# Altium project Controller-RK3562.PrjPcb (part 2 of 8)

## Sheet RK3562-POWER-GND.SchDoc
size 299 x 209 mm; SheetNumber: 4; SheetTotal: 32
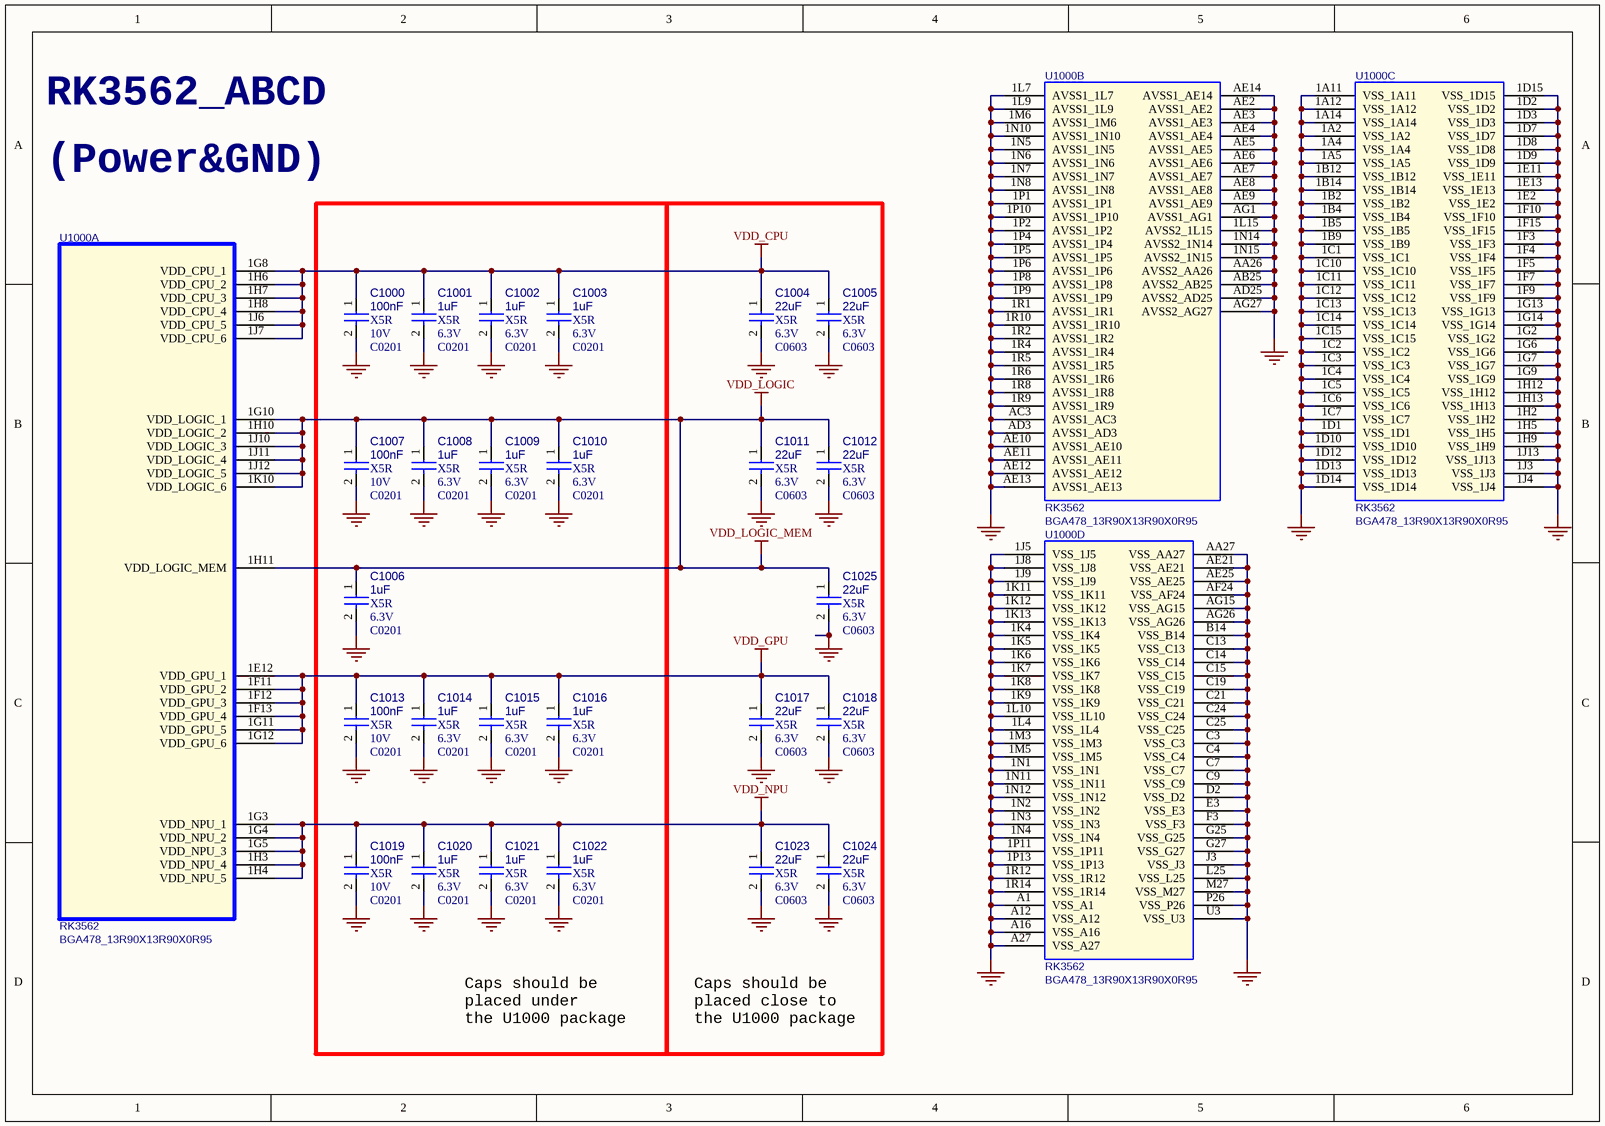
[diagram p5: RK3562-POWER-GND.SchDoc]

### Parts
C1000  100nF  Dielectric: X5R  Voltage: 10V  [C0201]
C1001  1uF  Dielectric: X5R  Voltage: 6.3V  [C0201]
C1002  1uF  Dielectric: X5R  Voltage: 6.3V  [C0201]
C1003  1uF  Dielectric: X5R  Voltage: 6.3V  [C0201]
C1004  22uF  Dielectric: X5R  Voltage: 6.3V  [C0603]
C1005  22uF  Dielectric: X5R  Voltage: 6.3V  [C0603]
C1006  1uF  Dielectric: X5R  Voltage: 6.3V  [C0201]
C1007  100nF  Dielectric: X5R  Voltage: 10V  [C0201]
C1008  1uF  Dielectric: X5R  Voltage: 6.3V  [C0201]
C1009  1uF  Dielectric: X5R  Voltage: 6.3V  [C0201]
C1010  1uF  Dielectric: X5R  Voltage: 6.3V  [C0201]
C1011  22uF  Dielectric: X5R  Voltage: 6.3V  [C0603]
C1012  22uF  Dielectric: X5R  Voltage: 6.3V  [C0603]
C1013  100nF  Dielectric: X5R  Voltage: 10V  [C0201]
C1014  1uF  Dielectric: X5R  Voltage: 6.3V  [C0201]
C1015  1uF  Dielectric: X5R  Voltage: 6.3V  [C0201]
C1016  1uF  Dielectric: X5R  Voltage: 6.3V  [C0201]
C1017  22uF  Dielectric: X5R  Voltage: 6.3V  [C0603]
C1018  22uF  Dielectric: X5R  Voltage: 6.3V  [C0603]
C1019  100nF  Dielectric: X5R  Voltage: 10V  [C0201]
C1020  1uF  Dielectric: X5R  Voltage: 6.3V  [C0201]
C1021  1uF  Dielectric: X5R  Voltage: 6.3V  [C0201]
C1022  1uF  Dielectric: X5R  Voltage: 6.3V  [C0201]
C1023  22uF  Dielectric: X5R  Voltage: 6.3V  [C0603]
C1024  22uF  Dielectric: X5R  Voltage: 6.3V  [C0603]
C1025  22uF  Dielectric: X5R  Voltage: 6.3V  [C0603]
U1000  RK3562  [BGA478_13R90X13R90X0R95]  (parts A,B,C,D of 16)

### Nets
GND: C1000.2 C1001.2 C1002.2 C1003.2 C1004.2 C1005.2 C1006.2 C1007.2 C1008.2 C1009.2 C1010.2 C1011.2 C1012.2 C1013.2 C1014.2 C1015.2 C1016.2 C1017.2 C1018.2 C1019.2 C1020.2 C1021.2 C1022.2 C1023.2 C1024.2 C1025.2 U1000.1A2(VSS_1A2) U1000.1A4(VSS_1A4) U1000.1A5(VSS_1A5) U1000.1A11(VSS_1A11) U1000.1A12(VSS_1A12) U1000.1A14(VSS_1A14) U1000.1B2(VSS_1B2) U1000.1B4(VSS_1B4) U1000.1B5(VSS_1B5) U1000.1B9(VSS_1B9) U1000.1B12(VSS_1B12) U1000.1B14(VSS_1B14) U1000.1C1(VSS_1C1) U1000.1C2(VSS_1C2) U1000.1C3(VSS_1C3) U1000.1C4(VSS_1C4) U1000.1C5(VSS_1C5) U1000.1C6(VSS_1C6) U1000.1C7(VSS_1C7) U1000.1C10(VSS_1C10) U1000.1C11(VSS_1C11) U1000.1C12(VSS_1C12) U1000.1C13(VSS_1C13) U1000.1C14(VSS_1C14) U1000.1C15(VSS_1C15) U1000.1D1(VSS_1D1) U1000.1D2(VSS_1D2) U1000.1D3(VSS_1D3) U1000.1D7(VSS_1D7) U1000.1D8(VSS_1D8) U1000.1D9(VSS_1D9) U1000.1D10(VSS_1D10) U1000.1D12(VSS_1D12) U1000.1D13(VSS_1D13) U1000.1D14(VSS_1D14) U1000.1D15(VSS_1D15) U1000.1E2(VSS_1E2) U1000.1E11(VSS_1E11) U1000.1E13(VSS_1E13) U1000.1F3(VSS_1F3) U1000.1F4(VSS_1F4) U1000.1F5(VSS_1F5) U1000.1F7(VSS_1F7) U1000.1F9(VSS_1F9) U1000.1F10(VSS_1F10) U1000.1F15(VSS_1F15) U1000.1G2(VSS_1G2) U1000.1G6(VSS_1G6) U1000.1G7(VSS_1G7) U1000.1G9(VSS_1G9) U1000.1G13(VSS_1G13) U1000.1G14(VSS_1G14) U1000.1H2(VSS_1H2) U1000.1H5(VSS_1H5) U1000.1H9(VSS_1H9) U1000.1H12(VSS_1H12) U1000.1H13(VSS_1H13) U1000.1J3(VSS_1J3) U1000.1J4(VSS_1J4) U1000.1J5(VSS_1J5) U1000.1J8(VSS_1J8) U1000.1J9(VSS_1J9) U1000.1J13(VSS_1J13) U1000.1K4(VSS_1K4) U1000.1K5(VSS_1K5) U1000.1K6(VSS_1K6) U1000.1K7(VSS_1K7) U1000.1K8(VSS_1K8) U1000.1K9(VSS_1K9) U1000.1K11(VSS_1K11) U1000.1K12(VSS_1K12) U1000.1K13(VSS_1K13) U1000.1L4(VSS_1L4) U1000.1L7(AVSS1_1L7) U1000.1L9(AVSS1_1L9) U1000.1L10(VSS_1L10) U1000.1L15(AVSS2_1L15) U1000.1M3(VSS_1M3) U1000.1M5(VSS_1M5) U1000.1M6(AVSS1_1M6) U1000.1N1(VSS_1N1) U1000.1N2(VSS_1N2) U1000.1N3(VSS_1N3) U1000.1N4(VSS_1N4) U1000.1N5(AVSS1_1N5) U1000.1N6(AVSS1_1N6) U1000.1N7(AVSS1_1N7) U1000.1N8(AVSS1_1N8) U1000.1N10(AVSS1_1N10) U1000.1N11(VSS_1N11) U1000.1N12(VSS_1N12) U1000.1N14(AVSS2_1N14) U1000.1N15(AVSS2_1N15) U1000.1P1(AVSS1_1P1) U1000.1P2(AVSS1_1P2) U1000.1P4(AVSS1_1P4) U1000.1P5(AVSS1_1P5) U1000.1P6(AVSS1_1P6) U1000.1P8(AVSS1_1P8) U1000.1P9(AVSS1_1P9) U1000.1P10(AVSS1_1P10) U1000.1P11(VSS_1P11) U1000.1P13(VSS_1P13) U1000.1R1(AVSS1_1R1) U1000.1R2(AVSS1_1R2) U1000.1R4(AVSS1_1R4) U1000.1R5(AVSS1_1R5) U1000.1R6(AVSS1_1R6) U1000.1R8(AVSS1_1R8) U1000.1R9(AVSS1_1R9) U1000.1R10(AVSS1_1R10) U1000.1R12(VSS_1R12) U1000.1R14(VSS_1R14) U1000.A1(VSS_A1) U1000.A12(VSS_A12) U1000.A16(VSS_A16) U1000.A27(VSS_A27) U1000.AA26(AVSS2_AA26) U1000.AA27(VSS_AA27) U1000.AB25(AVSS2_AB25) U1000.AC3(AVSS1_AC3) U1000.AD3(AVSS1_AD3) U1000.AD25(AVSS2_AD25) U1000.AE2(AVSS1_AE2) U1000.AE3(AVSS1_AE3) U1000.AE4(AVSS1_AE4) U1000.AE5(AVSS1_AE5) U1000.AE6(AVSS1_AE6) U1000.AE7(AVSS1_AE7) U1000.AE8(AVSS1_AE8) U1000.AE9(AVSS1_AE9) U1000.AE10(AVSS1_AE10) U1000.AE11(AVSS1_AE11) U1000.AE12(AVSS1_AE12) U1000.AE13(AVSS1_AE13) U1000.AE14(AVSS1_AE14) U1000.AE21(VSS_AE21) U1000.AE25(VSS_AE25) U1000.AF24(VSS_AF24) U1000.AG1(AVSS1_AG1) U1000.AG15(VSS_AG15) U1000.AG26(VSS_AG26) U1000.AG27(AVSS2_AG27) U1000.B14(VSS_B14) U1000.C3(VSS_C3) U1000.C4(VSS_C4) U1000.C7(VSS_C7) U1000.C9(VSS_C9) U1000.C13(VSS_C13) U1000.C14(VSS_C14) U1000.C15(VSS_C15) U1000.C19(VSS_C19) U1000.C21(VSS_C21) U1000.C24(VSS_C24) U1000.C25(VSS_C25) U1000.D2(VSS_D2) U1000.E3(VSS_E3) U1000.F3(VSS_F3) U1000.G25(VSS_G25) U1000.G27(VSS_G27) U1000.J3(VSS_J3) U1000.L25(VSS_L25) U1000.M27(VSS_M27) U1000.P26(VSS_P26) U1000.U3(VSS_U3)
VDD_CPU: C1000.1 C1001.1 C1002.1 C1003.1 C1004.1 C1005.1 U1000.1G8(VDD_CPU_1) U1000.1H6(VDD_CPU_2) U1000.1H7(VDD_CPU_3) U1000.1H8(VDD_CPU_4) U1000.1J6(VDD_CPU_5) U1000.1J7(VDD_CPU_6)
VDD_GPU: C1013.1 C1014.1 C1015.1 C1016.1 C1017.1 C1018.1 U1000.1E12(VDD_GPU_1) U1000.1F11(VDD_GPU_2) U1000.1F12(VDD_GPU_3) U1000.1F13(VDD_GPU_4) U1000.1G11(VDD_GPU_5) U1000.1G12(VDD_GPU_6)
VDD_LOGIC: C1006.1 C1007.1 C1008.1 C1009.1 C1010.1 C1011.1 C1012.1 C1025.1 U1000.1G10(VDD_LOGIC_1) U1000.1H10(VDD_LOGIC_2) U1000.1H11(VDD_LOGIC_MEM) U1000.1J10(VDD_LOGIC_3) U1000.1J11(VDD_LOGIC_4) U1000.1J12(VDD_LOGIC_5) U1000.1K10(VDD_LOGIC_6)  [also labelled VDD_LOGIC_MEM]
VDD_NPU: C1019.1 C1020.1 C1021.1 C1022.1 C1023.1 C1024.1 U1000.1G3(VDD_NPU_1) U1000.1G4(VDD_NPU_2) U1000.1G5(VDD_NPU_3) U1000.1H3(VDD_NPU_4) U1000.1H4(VDD_NPU_5)

### Notes on the sheet
- RK3562_ABCD
- (Power&GND)
- Caps should be
  placed under
  the U1000 package
- Caps should be
  placed close to
  the U1000 package

### Library data of the parts
C1000 = CAP NP: cap,100.00nF,+/-10%,10V,X5R,C0201; Part Reference: C1000; Manufacturer PN: C0603X5R1A104K030BC; Manufacturer: TDK; Tolerance: 10%; Priority: A; PCB Footprint: C0201; Value: 100nF; Created by: JJJ; Part Type: C0201; RK PN: C0603X5R1A104K030BC; ClassName: RK
C1001 = CAP NP: cap,1.00uF,+/-20%,6.3V,X5R,C0201; Part Reference: C1001; Manufacturer: TDK; RK PN: C0603X5R0J105M030BC; Priority: A; Tolerance: 20%; PCB Footprint: C0201; Value: 1uF; Part Type: C0201; Manufacturer PN: C0603X5R0J105M030BC; Created by: JJJ; ClassName: RK
C1002 = CAP NP: cap,1.00uF,+/-20%,6.3V,X5R,C0201; Part Reference: C1002; Manufacturer PN: C0603X5R0J105M030BC; Manufacturer: TDK; Tolerance: 20%; Priority: A; PCB Footprint: C0201; Value: 1uF; Created by: JJJ; Part Type: C0201; RK PN: C0603X5R0J105M030BC; ClassName: RK
C1003 = CAP NP: cap,1.00uF,+/-20%,6.3V,X5R,C0201; Part Reference: C1003; Manufacturer PN: C0603X5R0J105M030BC; Manufacturer: TDK; Tolerance: 20%; Priority: A; PCB Footprint: C0201; Value: 1uF; Created by: JJJ; Part Type: C0201; RK PN: C0603X5R0J105M030BC; ClassName: RK
C1004 = CAP NP: cap,22.00uF,+/-20%,6.3V,X5R,C0603; Part Reference: C1004; Manufacturer PN: C1608X5R0J226M080AC; Manufacturer: TDK; Tolerance: 20%; Priority: A; PCB Footprint: C0603; Value: 22uF; Created by: JJJ; C_Voltage: 6.3V; Part Type: C0603; RK PN: C1608X5R0J226M080AC; ClassName: RK
C1005 = CAP NP: cap,22.00uF,+/-20%,6.3V,X5R,C0603; Part Reference: C1005; Manufacturer PN: C1608X5R0J226M080AC; Manufacturer: TDK; Tolerance: 20%; Priority: A; PCB Footprint: C0603; Value: 22uF; Created by: JJJ; C_Voltage: 6.3V; Part Type: C0603; RK PN: C1608X5R0J226M080AC; ClassName: RK
C1006 = CAP NP: cap,1.00uF,+/-20%,6.3V,X5R,C0201; Part Reference: C1006; Manufacturer PN: C0603X5R0J105M030BC; Manufacturer: TDK; Tolerance: 20%; Priority: A; PCB Footprint: C0201; Value: 1uF; Created by: JJJ; Part Type: C0201; RK PN: C0603X5R0J105M030BC; ClassName: RK
C1007 = CAP NP: cap,100.00nF,+/-10%,10V,X5R,C0201; Part Reference: C1007; Manufacturer PN: C0603X5R1A104K030BC; Manufacturer: TDK; Tolerance: 10%; Priority: A; PCB Footprint: C0201; Value: 100nF; Created by: JJJ; Part Type: C0201; RK PN: C0603X5R1A104K030BC; ClassName: RK
C1008 = CAP NP: cap,1.00uF,+/-20%,6.3V,X5R,C0201; Part Reference: C1008; Manufacturer: TDK; RK PN: C0603X5R0J105M030BC; Priority: A; Tolerance: 20%; PCB Footprint: C0201; Value: 1uF; Part Type: C0201; Manufacturer PN: C0603X5R0J105M030BC; Created by: JJJ; ClassName: RK
C1009 = CAP NP: cap,1.00uF,+/-20%,6.3V,X5R,C0201; Part Reference: C1009; Manufacturer PN: C0603X5R0J105M030BC; Manufacturer: TDK; Tolerance: 20%; Priority: A; PCB Footprint: C0201; Value: 1uF; Created by: JJJ; Part Type: C0201; RK PN: C0603X5R0J105M030BC; ClassName: RK
C1010 = CAP NP: cap,1.00uF,+/-20%,6.3V,X5R,C0201; Part Reference: C1010; Manufacturer PN: C0603X5R0J105M030BC; Manufacturer: TDK; Tolerance: 20%; Priority: A; PCB Footprint: C0201; Value: 1uF; Created by: JJJ; Part Type: C0201; RK PN: C0603X5R0J105M030BC; ClassName: RK
C1011 = CAP NP: cap,22.00uF,+/-20%,6.3V,X5R,C0603; Part Reference: C1011; Manufacturer PN: C1608X5R0J226M080AC; Manufacturer: TDK; Tolerance: 20%; Priority: A; PCB Footprint: C0603; Value: 22uF; Created by: JJJ; C_Voltage: 6.3V; Part Type: C0603; RK PN: C1608X5R0J226M080AC; ClassName: RK
C1012 = CAP NP: cap,22.00uF,+/-20%,6.3V,X5R,C0603; Part Reference: C1012; Manufacturer PN: C1608X5R0J226M080AC; Manufacturer: TDK; Tolerance: 20%; Priority: A; PCB Footprint: C0603; Value: 22uF; Created by: JJJ; C_Voltage: 6.3V; Part Type: C0603; RK PN: C1608X5R0J226M080AC; ClassName: RK
C1013 = CAP NP: cap,100.00nF,+/-10%,10V,X5R,C0201; Part Reference: C1013; Manufacturer PN: C0603X5R1A104K030BC; Manufacturer: TDK; Tolerance: 10%; Priority: A; PCB Footprint: C0201; Value: 100nF; Created by: JJJ; Part Type: C0201; RK PN: C0603X5R1A104K030BC; ClassName: RK
C1014 = CAP NP: cap,1.00uF,+/-20%,6.3V,X5R,C0201; Part Reference: C1014; Manufacturer: TDK; RK PN: C0603X5R0J105M030BC; Priority: A; Tolerance: 20%; PCB Footprint: C0201; Value: 1uF; Part Type: C0201; Manufacturer PN: C0603X5R0J105M030BC; Created by: JJJ; ClassName: RK
C1015 = CAP NP: cap,1.00uF,+/-20%,6.3V,X5R,C0201; Part Reference: C1015; Manufacturer PN: C0603X5R0J105M030BC; Manufacturer: TDK; Tolerance: 20%; Priority: A; PCB Footprint: C0201; Value: 1uF; Created by: JJJ; Part Type: C0201; RK PN: C0603X5R0J105M030BC; ClassName: RK
C1016 = CAP NP: cap,1.00uF,+/-20%,6.3V,X5R,C0201; Part Reference: C1016; Manufacturer PN: C0603X5R0J105M030BC; Manufacturer: TDK; Tolerance: 20%; Priority: A; PCB Footprint: C0201; Value: 1uF; Created by: JJJ; Part Type: C0201; RK PN: C0603X5R0J105M030BC; ClassName: RK
C1017 = CAP NP: cap,22.00uF,+/-20%,6.3V,X5R,C0603; Part Reference: C1017; Manufacturer PN: C1608X5R0J226M080AC; Manufacturer: TDK; Tolerance: 20%; Priority: A; PCB Footprint: C0603; Value: 22uF; Created by: JJJ; C_Voltage: 6.3V; Part Type: C0603; RK PN: C1608X5R0J226M080AC; ClassName: RK
C1018 = CAP NP: cap,22.00uF,+/-20%,6.3V,X5R,C0603; Part Reference: C1018; Manufacturer PN: C1608X5R0J226M080AC; Manufacturer: TDK; Tolerance: 20%; Priority: A; PCB Footprint: C0603; Value: 22uF; Created by: JJJ; C_Voltage: 6.3V; Part Type: C0603; RK PN: C1608X5R0J226M080AC; ClassName: RK
C1019 = CAP NP: cap,100.00nF,+/-10%,10V,X5R,C0201; Part Reference: C1019; Manufacturer PN: C0603X5R1A104K030BC; Manufacturer: TDK; Tolerance: 10%; Priority: A; PCB Footprint: C0201; Value: 100nF; Created by: JJJ; Part Type: C0201; RK PN: C0603X5R1A104K030BC; ClassName: RK
C1020 = CAP NP: cap,1.00uF,+/-20%,6.3V,X5R,C0201; Part Reference: C1020; Manufacturer: TDK; RK PN: C0603X5R0J105M030BC; Priority: A; Tolerance: 20%; PCB Footprint: C0201; Value: 1uF; Part Type: C0201; Manufacturer PN: C0603X5R0J105M030BC; Created by: JJJ; ClassName: RK
C1021 = CAP NP: cap,1.00uF,+/-20%,6.3V,X5R,C0201; Part Reference: C1021; Manufacturer PN: C0603X5R0J105M030BC; Manufacturer: TDK; Tolerance: 20%; Priority: A; PCB Footprint: C0201; Value: 1uF; Created by: JJJ; Part Type: C0201; RK PN: C0603X5R0J105M030BC; ClassName: RK
C1022 = CAP NP: cap,1.00uF,+/-20%,6.3V,X5R,C0201; Part Reference: C1022; Manufacturer: TDK; RK PN: C0603X5R0J105M030BC; Priority: A; Tolerance: 20%; PCB Footprint: C0201; Value: 1uF; Part Type: C0201; Manufacturer PN: C0603X5R0J105M030BC; Created by: JJJ; ClassName: RK
C1023 = CAP NP: cap,22.00uF,+/-20%,6.3V,X5R,C0603; Part Reference: C1023; Manufacturer PN: C1608X5R0J226M080AC; Manufacturer: TDK; Tolerance: 20%; Priority: A; PCB Footprint: C0603; Value: 22uF; Created by: JJJ; C_Voltage: 6.3V; Part Type: C0603; RK PN: C1608X5R0J226M080AC; ClassName: RK
C1024 = CAP NP: cap,22.00uF,+/-20%,6.3V,X5R,C0603; Part Reference: C1024; Manufacturer PN: C1608X5R0J226M080AC; Manufacturer: TDK; Tolerance: 20%; Priority: A; PCB Footprint: C0603; Value: 22uF; Created by: JJJ; C_Voltage: 6.3V; Part Type: C0603; RK PN: C1608X5R0J226M080AC; ClassName: RK
C1025 = CAP NP: cap,22.00uF,+/-20%,6.3V,X5R,C0603; Part Reference: C1025; Manufacturer: TDK; RK PN: C1608X5R0J226M080AC; Priority: A; Tolerance: 20%; PCB Footprint: C0603; Value: 22uF; Part Type: C0603; C_Voltage: 6.3V; Manufacturer PN: C1608X5R0J226M080AC; Created by: JJJ; ClassName: RK
U1000 = SOC_RK3562: ROCKCHIP SOC; Part Reference: U1000; Manufacturer: Rockchip (瑞芯微); SPLIT_INST: TRUE; SWAP_INFO: (S1+S2+S3+S4+S5+S6+S7+S8+S9+S10+S11+S12+S13+S14+S15+S16); Priority: A; RK PN: 906000425; PCB Footprint: BGA478_13R90X13R90X0R95; Value: RK3562; Created by: JJJ; Manufacturer PN: RK3562; Part Type: SOC; ClassName: RK

## Sheet RK3562-DDR-PHY.SchDoc
size 420 x 297 mm; SheetNumber: 5; SheetTotal: 32
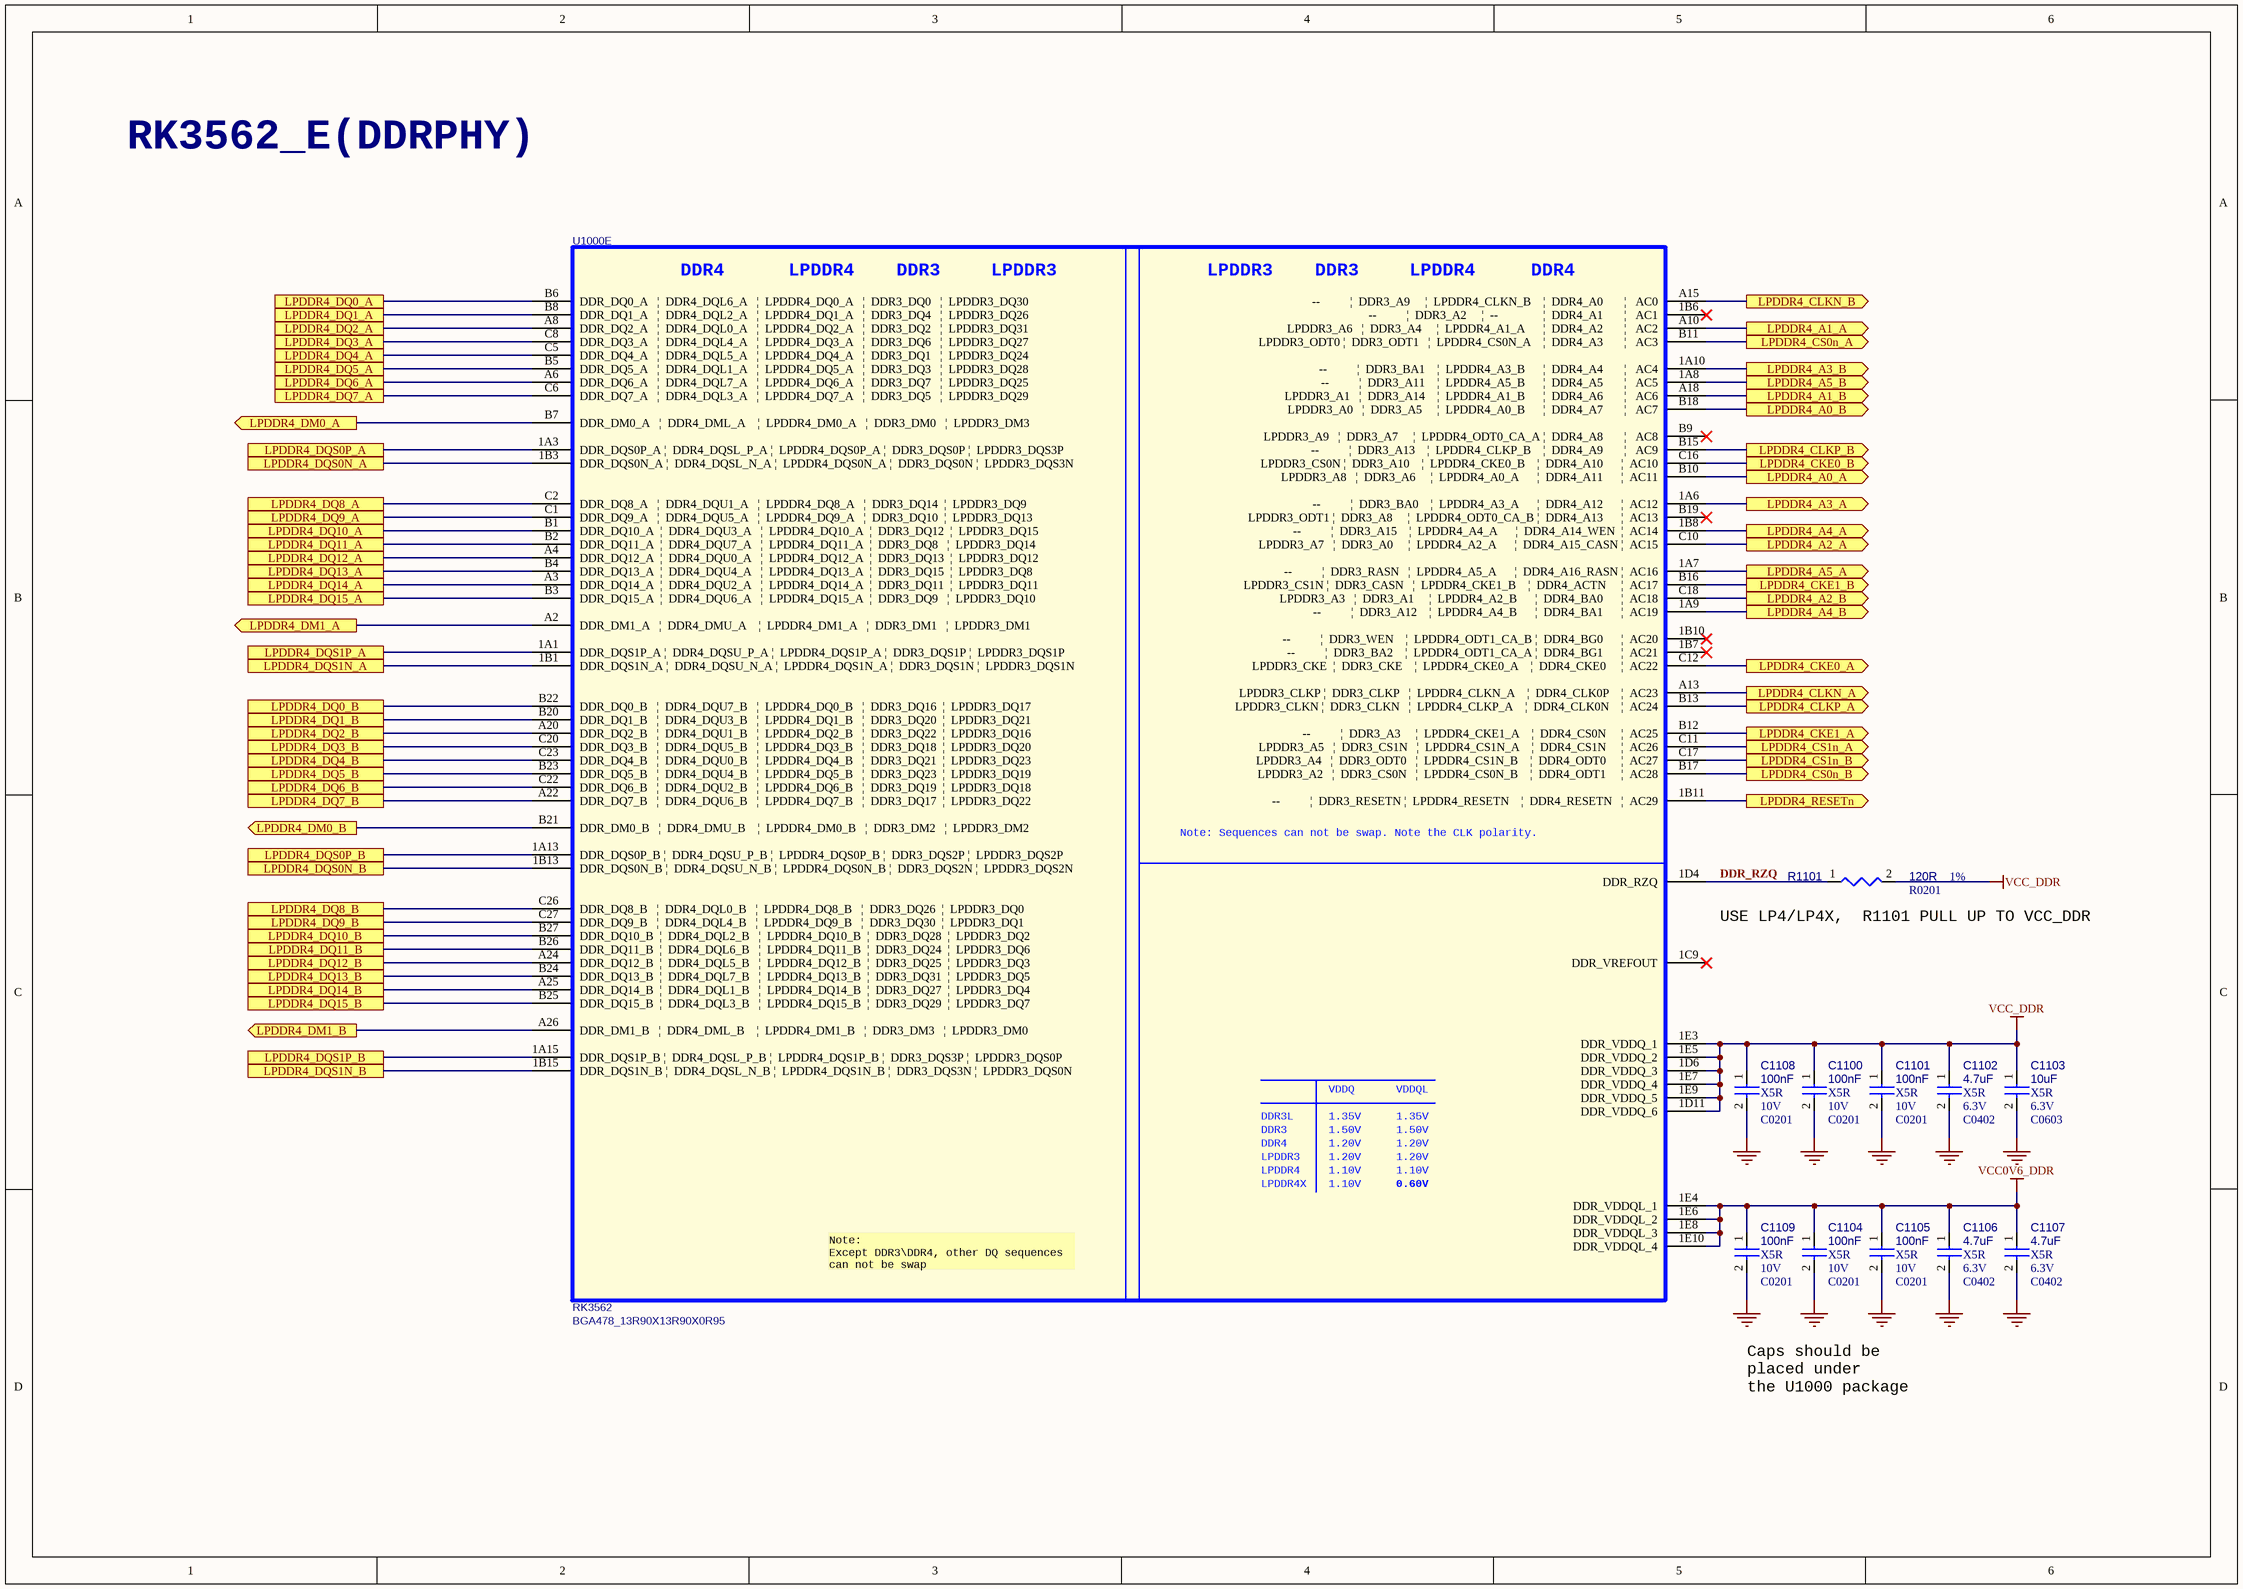
[diagram p6: RK3562-DDR-PHY.SchDoc]

### Parts
C1100  100nF  Dielectric: X5R  Voltage: 10V  [C0201]
C1101  100nF  Dielectric: X5R  Voltage: 10V  [C0201]
C1102  4.7uF  Dielectric: X5R  Voltage: 6.3V  [C0402]
C1103  10uF  Dielectric: X5R  Voltage: 6.3V  [C0603]
C1104  100nF  Dielectric: X5R  Voltage: 10V  [C0201]
C1105  100nF  Dielectric: X5R  Voltage: 10V  [C0201]
C1106  4.7uF  Dielectric: X5R  Voltage: 6.3V  [C0402]
C1107  4.7uF  Dielectric: X5R  Voltage: 6.3V  [C0402]
C1108  100nF  Dielectric: X5R  Voltage: 10V  [C0201]
C1109  100nF  Dielectric: X5R  Voltage: 10V  [C0201]
R1101  120R  Tolerance: 1%  [R0201]
U1000  RK3562  [BGA478_13R90X13R90X0R95]  (part E of 16)

### Ports
LPDDR4_A0_A (out, see CONTROLLER-RK3562[6B], DDR-LPDDR4[1B]), LPDDR4_A0_B (out, see CONTROLLER-RK3562[6C], DDR-LPDDR4[3B]), LPDDR4_A1_A (out, see CONTROLLER-RK3562[6B], DDR-LPDDR4[1B]), LPDDR4_A1_B (out, see CONTROLLER-RK3562[6C], DDR-LPDDR4[3B]), LPDDR4_A2_A (out, see CONTROLLER-RK3562[6B], DDR-LPDDR4[1B]), LPDDR4_A2_B (out, see CONTROLLER-RK3562[6C], DDR-LPDDR4[3B]), LPDDR4_A3_A (out, see CONTROLLER-RK3562[6B], DDR-LPDDR4[1B]), LPDDR4_A3_B (out, see CONTROLLER-RK3562[6C], DDR-LPDDR4[3B]), LPDDR4_A4_A (out, see CONTROLLER-RK3562[6B], DDR-LPDDR4[1B]), LPDDR4_A4_B (out, see CONTROLLER-RK3562[6C], DDR-LPDDR4[3B]), LPDDR4_A5_A (out, see CONTROLLER-RK3562[6B], DDR-LPDDR4[1B]), LPDDR4_A5_B (out, see CONTROLLER-RK3562[6C], DDR-LPDDR4[3B]), LPDDR4_CKE0_A (out, see CONTROLLER-RK3562[6B], DDR-LPDDR4[1B]), LPDDR4_CKE0_B (out, see CONTROLLER-RK3562[6C], DDR-LPDDR4[3B]), LPDDR4_CKE1_A (out, see CONTROLLER-RK3562[6B], DDR-LPDDR4[1B]), LPDDR4_CKE1_B (out, see CONTROLLER-RK3562[6C], DDR-LPDDR4[3B]), LPDDR4_CLKN_A (out, see CONTROLLER-RK3562[6B], DDR-LPDDR4[1B]), LPDDR4_CLKN_B (out, see CONTROLLER-RK3562[6C], DDR-LPDDR4[3B]), LPDDR4_CLKP_A (out, see CONTROLLER-RK3562[6B], DDR-LPDDR4[1B]), LPDDR4_CLKP_B (out, see CONTROLLER-RK3562[6C], DDR-LPDDR4[3B]), LPDDR4_CS0n_A (out, see CONTROLLER-RK3562[6B], DDR-LPDDR4[1B]), LPDDR4_CS0n_B (out, see CONTROLLER-RK3562[6C], DDR-LPDDR4[3B]), LPDDR4_CS1n_A (out, see CONTROLLER-RK3562[6B], DDR-LPDDR4[1B]), LPDDR4_CS1n_B (out, see CONTROLLER-RK3562[6C], DDR-LPDDR4[3B]), LPDDR4_DM0_A (out, see CONTROLLER-RK3562[6B], DDR-LPDDR4[1A]), LPDDR4_DM0_B (out, see CONTROLLER-RK3562[6C], DDR-LPDDR4[3A]), LPDDR4_DM1_A (out, see CONTROLLER-RK3562[6B], DDR-LPDDR4[1B]), LPDDR4_DM1_B (out, see CONTROLLER-RK3562[6C], DDR-LPDDR4[3B]), LPDDR4_DQ0_A (see CONTROLLER-RK3562[6B], DDR-LPDDR4[2A]), LPDDR4_DQ0_B (see CONTROLLER-RK3562[6C], DDR-LPDDR4[3A]), LPDDR4_DQ1_A (see CONTROLLER-RK3562[6B], DDR-LPDDR4[2A]), LPDDR4_DQ1_B (see CONTROLLER-RK3562[6C], DDR-LPDDR4[3A]), LPDDR4_DQ2_A (see CONTROLLER-RK3562[6B], DDR-LPDDR4[2A]), LPDDR4_DQ2_B (see CONTROLLER-RK3562[6C], DDR-LPDDR4[3A]), LPDDR4_DQ3_A (see CONTROLLER-RK3562[6B], DDR-LPDDR4[2A]), LPDDR4_DQ3_B (see CONTROLLER-RK3562[6C], DDR-LPDDR4[3A]), LPDDR4_DQ4_A (see CONTROLLER-RK3562[6B], DDR-LPDDR4[2A]), LPDDR4_DQ4_B (see CONTROLLER-RK3562[6C], DDR-LPDDR4[3A]), LPDDR4_DQ5_A (see CONTROLLER-RK3562[6B], DDR-LPDDR4[2A]), LPDDR4_DQ5_B (see CONTROLLER-RK3562[6C], DDR-LPDDR4[3A]), LPDDR4_DQ6_A (see CONTROLLER-RK3562[6B], DDR-LPDDR4[2A]), LPDDR4_DQ6_B (see CONTROLLER-RK3562[6C], DDR-LPDDR4[3A]), LPDDR4_DQ7_A (see CONTROLLER-RK3562[6B], DDR-LPDDR4[2A]), LPDDR4_DQ7_B (see CONTROLLER-RK3562[6C], DDR-LPDDR4[3A]), LPDDR4_DQ8_A (see CONTROLLER-RK3562[6B], DDR-LPDDR4[2A]), LPDDR4_DQ8_B (see CONTROLLER-RK3562[6C], DDR-LPDDR4[3A]), LPDDR4_DQ9_A (see CONTROLLER-RK3562[6B], DDR-LPDDR4[2A]), LPDDR4_DQ9_B (see CONTROLLER-RK3562[6C], DDR-LPDDR4[3A]), LPDDR4_DQ10_A (see CONTROLLER-RK3562[6B], DDR-LPDDR4[2A]), LPDDR4_DQ10_B (see CONTROLLER-RK3562[6C], DDR-LPDDR4[3A]), LPDDR4_DQ11_A (see CONTROLLER-RK3562[6B], DDR-LPDDR4[2A]), LPDDR4_DQ11_B (see CONTROLLER-RK3562[6C], DDR-LPDDR4[3A]), LPDDR4_DQ12_A (see CONTROLLER-RK3562[6B], DDR-LPDDR4[2A]), LPDDR4_DQ12_B (see CONTROLLER-RK3562[6C], DDR-LPDDR4[3A]), LPDDR4_DQ13_A (see CONTROLLER-RK3562[6B], DDR-LPDDR4[2A]), LPDDR4_DQ13_B (see CONTROLLER-RK3562[6C], DDR-LPDDR4[3A]), LPDDR4_DQ14_A (see CONTROLLER-RK3562[6B], DDR-LPDDR4[2A]), LPDDR4_DQ14_B (see CONTROLLER-RK3562[6C], DDR-LPDDR4[3A]), LPDDR4_DQ15_A (see CONTROLLER-RK3562[6B], DDR-LPDDR4[2A]), LPDDR4_DQ15_B (see CONTROLLER-RK3562[6C], DDR-LPDDR4[3A]), LPDDR4_DQS0N_A (see CONTROLLER-RK3562[6B], DDR-LPDDR4[2A]), LPDDR4_DQS0N_B (see CONTROLLER-RK3562[6C], DDR-LPDDR4[3A]), LPDDR4_DQS0P_A (see CONTROLLER-RK3562[6B], DDR-LPDDR4[2A]), LPDDR4_DQS0P_B (see CONTROLLER-RK3562[6C], DDR-LPDDR4[3A]), LPDDR4_DQS1N_A (see CONTROLLER-RK3562[6B], DDR-LPDDR4[1B]), LPDDR4_DQS1N_B (see CONTROLLER-RK3562[6C], DDR-LPDDR4[3B]), LPDDR4_DQS1P_A (see CONTROLLER-RK3562[6B], DDR-LPDDR4[1A]), LPDDR4_DQS1P_B (see CONTROLLER-RK3562[6C], DDR-LPDDR4[3A]), LPDDR4_RESETn (out, see CONTROLLER-RK3562[6C], DDR-LPDDR4[3C])

### Nets
GND: C1100.2 C1101.2 C1102.2 C1103.2 C1104.2 C1105.2 C1106.2 C1107.2 C1108.2 C1109.2
VCC0V6_DDR: C1104.1 C1105.1 C1106.1 C1107.1 C1109.1 U1000.1E4(DDR_VDDQL_1) U1000.1E6(DDR_VDDQL_2) U1000.1E8(DDR_VDDQL_3) U1000.1E10(DDR_VDDQL_4)
VCC_DDR: C1100.1 C1101.1 C1102.1 C1103.1 C1108.1 R1101.2 U1000.1D6(DDR_VDDQ_3) U1000.1D11(DDR_VDDQ_6) U1000.1E3(DDR_VDDQ_1) U1000.1E5(DDR_VDDQ_2) U1000.1E7(DDR_VDDQ_4) U1000.1E9(DDR_VDDQ_5)
DDR_RZQ: R1101.1 U1000.1D4(DDR_RZQ)
NetC3001_1: U1000.1B11(--__________|__DDR3_RESETN_|__LPDDR4_RESETN____|__DDR4_RESETN___|__AC29) ; port LPDDR4_RESETn
NetU1000_1A1: U1000.1A1(DDR_DQS1P_A_|__DDR4_DQSU_P_A_|__LPDDR4_DQS1P_A_|__DDR3_DQS1P_|__LPDDR3_DQS1P) ; port LPDDR4_DQS1P_A
NetU1000_1A3: U1000.1A3(DDR_DQS0P_A_|__DDR4_DQSL_P_A_|__LPDDR4_DQS0P_A_|__DDR3_DQS0P_|__LPDDR3_DQS3P) ; port LPDDR4_DQS0P_A
NetU1000_1A6: U1000.1A6(--__________|__DDR3_BA0____|__LPDDR4_A3_A______|__DDR4_A12______|__AC12) ; port LPDDR4_A3_A
NetU1000_1A7: U1000.1A7(--__________|__DDR3_RASN___|__LPDDR4_A5_A______|__DDR4_A16_RASN_|__AC16) ; port LPDDR4_A5_A
NetU1000_1A8: U1000.1A8(--__________|__DDR3_A11____|__LPDDR4_A5_B______|__DDR4_A5_______|___AC5) ; port LPDDR4_A5_B
NetU1000_1A9: U1000.1A9(--__________|__DDR3_A12____|__LPDDR4_A4_B______|__DDR4_BA1______|__AC19) ; port LPDDR4_A4_B
NetU1000_1A10: U1000.1A10(--__________|__DDR3_BA1____|__LPDDR4_A3_B______|__DDR4_A4_______|___AC4) ; port LPDDR4_A3_B
NetU1000_1A13: U1000.1A13(DDR_DQS0P_B_|__DDR4_DQSU_P_B_|__LPDDR4_DQS0P_B_|__DDR3_DQS2P_|__LPDDR3_DQS2P) ; port LPDDR4_DQS0P_B
NetU1000_1A15: U1000.1A15(DDR_DQS1P_B_|__DDR4_DQSL_P_B_|__LPDDR4_DQS1P_B_|__DDR3_DQS3P_|__LPDDR3_DQS0P) ; port LPDDR4_DQS1P_B
NetU1000_1B1: U1000.1B1(DDR_DQS1N_A_|__DDR4_DQSU_N_A_|__LPDDR4_DQS1N_A_|__DDR3_DQS1N_|__LPDDR3_DQS1N) ; port LPDDR4_DQS1N_A
NetU1000_1B3: U1000.1B3(DDR_DQS0N_A_|__DDR4_DQSL_N_A_|__LPDDR4_DQS0N_A_|__DDR3_DQS0N_|__LPDDR3_DQS3N) ; port LPDDR4_DQS0N_A
NetU1000_1B8: U1000.1B8(--__________|__DDR3_A15____|__LPDDR4_A4_A______|__DDR4_A14_WEN__|__AC14) ; port LPDDR4_A4_A
NetU1000_1B13: U1000.1B13(DDR_DQS0N_B_|__DDR4_DQSU_N_B_|__LPDDR4_DQS0N_B_|__DDR3_DQS2N_|__LPDDR3_DQS2N) ; port LPDDR4_DQS0N_B
NetU1000_1B15: U1000.1B15(DDR_DQS1N_B_|__DDR4_DQSL_N_B_|__LPDDR4_DQS1N_B_|__DDR3_DQS3N_|__LPDDR3_DQS0N) ; port LPDDR4_DQS1N_B
NetU1000_A2: U1000.A2(DDR_DM1_A___|__DDR4_DMU_A____|__LPDDR4_DM1_A___|__DDR3_DM1___|__LPDDR3_DM1) ; port LPDDR4_DM1_A
NetU1000_A3: U1000.A3(DDR_DQ14_A__|__DDR4_DQU2_A___|__LPDDR4_DQ14_A__|__DDR3_DQ11__|__LPDDR3_DQ11) ; port LPDDR4_DQ14_A
NetU1000_A4: U1000.A4(DDR_DQ12_A__|__DDR4_DQU0_A___|__LPDDR4_DQ12_A__|__DDR3_DQ13__|__LPDDR3_DQ12) ; port LPDDR4_DQ12_A
NetU1000_A6: U1000.A6(DDR_DQ6_A___|__DDR4_DQL7_A___|__LPDDR4_DQ6_A___|__DDR3_DQ7___|__LPDDR3_DQ25) ; port LPDDR4_DQ6_A
NetU1000_A8: U1000.A8(DDR_DQ2_A___|__DDR4_DQL0_A___|__LPDDR4_DQ2_A___|__DDR3_DQ2___|__LPDDR3_DQ31) ; port LPDDR4_DQ2_A
NetU1000_A10: U1000.A10(LPDDR3_A6___|__DDR3_A4_____|__LPDDR4_A1_A______|__DDR4_A2_______|___AC2) ; port LPDDR4_A1_A
NetU1000_A13: U1000.A13(LPDDR3_CLKP_|__DDR3_CLKP___|__LPDDR4_CLKN_A____|__DDR4_CLK0P____|__AC23) ; port LPDDR4_CLKN_A
NetU1000_A15: U1000.A15(--__________|__DDR3_A9_____|__LPDDR4_CLKN_B____|__DDR4_A0_______|___AC0) ; port LPDDR4_CLKN_B
NetU1000_A18: U1000.A18(LPDDR3_A1___|__DDR3_A14____|__LPDDR4_A1_B______|__DDR4_A6_______|___AC6) ; port LPDDR4_A1_B
NetU1000_A20: U1000.A20(DDR_DQ2_B___|__DDR4_DQU1_B___|__LPDDR4_DQ2_B___|__DDR3_DQ22__|__LPDDR3_DQ16) ; port LPDDR4_DQ2_B
NetU1000_A22: U1000.A22(DDR_DQ7_B___|__DDR4_DQU6_B___|__LPDDR4_DQ7_B___|__DDR3_DQ17__|__LPDDR3_DQ22) ; port LPDDR4_DQ7_B
NetU1000_A24: U1000.A24(DDR_DQ12_B__|__DDR4_DQL5_B___|__LPDDR4_DQ12_B__|__DDR3_DQ25__|__LPDDR3_DQ3) ; port LPDDR4_DQ12_B
NetU1000_A25: U1000.A25(DDR_DQ14_B__|__DDR4_DQL1_B___|__LPDDR4_DQ14_B__|__DDR3_DQ27__|__LPDDR3_DQ4) ; port LPDDR4_DQ14_B
NetU1000_A26: U1000.A26(DDR_DM1_B___|__DDR4_DML_B____|__LPDDR4_DM1_B___|__DDR3_DM3___|__LPDDR3_DM0) ; port LPDDR4_DM1_B
NetU1000_B1: U1000.B1(DDR_DQ10_A__|__DDR4_DQU3_A___|__LPDDR4_DQ10_A__|__DDR3_DQ12__|__LPDDR3_DQ15) ; port LPDDR4_DQ10_A
NetU1000_B2: U1000.B2(DDR_DQ11_A__|__DDR4_DQU7_A___|__LPDDR4_DQ11_A__|__DDR3_DQ8___|__LPDDR3_DQ14) ; port LPDDR4_DQ11_A
NetU1000_B3: U1000.B3(DDR_DQ15_A__|__DDR4_DQU6_A___|__LPDDR4_DQ15_A__|__DDR3_DQ9___|__LPDDR3_DQ10) ; port LPDDR4_DQ15_A
NetU1000_B4: U1000.B4(DDR_DQ13_A__|__DDR4_DQU4_A___|__LPDDR4_DQ13_A__|__DDR3_DQ15__|__LPDDR3_DQ8) ; port LPDDR4_DQ13_A
NetU1000_B5: U1000.B5(DDR_DQ5_A___|__DDR4_DQL1_A___|__LPDDR4_DQ5_A___|__DDR3_DQ3___|__LPDDR3_DQ28) ; port LPDDR4_DQ5_A
NetU1000_B6: U1000.B6(DDR_DQ0_A___|__DDR4_DQL6_A___|__LPDDR4_DQ0_A___|__DDR3_DQ0___|__LPDDR3_DQ30) ; port LPDDR4_DQ0_A
NetU1000_B7: U1000.B7(DDR_DM0_A___|__DDR4_DML_A____|__LPDDR4_DM0_A___|__DDR3_DM0___|__LPDDR3_DM3) ; port LPDDR4_DM0_A
NetU1000_B8: U1000.B8(DDR_DQ1_A___|__DDR4_DQL2_A___|__LPDDR4_DQ1_A___|__DDR3_DQ4___|__LPDDR3_DQ26) ; port LPDDR4_DQ1_A
NetU1000_B10: U1000.B10(LPDDR3_A8___|__DDR3_A6_____|__LPDDR4_A0_A______|__DDR4_A11______|__AC11) ; port LPDDR4_A0_A
NetU1000_B11: U1000.B11(LPDDR3_ODT0_|__DDR3_ODT1___|__LPDDR4_CS0N_A____|__DDR4_A3_______|___AC3) ; port LPDDR4_CS0n_A
NetU1000_B12: U1000.B12(--__________|__DDR3_A3_____|__LPDDR4_CKE1_A____|__DDR4_CS0N_____|__AC25) ; port LPDDR4_CKE1_A
NetU1000_B13: U1000.B13(LPDDR3_CLKN_|__DDR3_CLKN___|__LPDDR4_CLKP_A____|__DDR4_CLK0N____|__AC24) ; port LPDDR4_CLKP_A
NetU1000_B15: U1000.B15(--__________|__DDR3_A13____|__LPDDR4_CLKP_B____|__DDR4_A9_______|___AC9) ; port LPDDR4_CLKP_B
NetU1000_B16: U1000.B16(LPDDR3_CS1N_|__DDR3_CASN___|__LPDDR4_CKE1_B____|__DDR4_ACTN_____|__AC17) ; port LPDDR4_CKE1_B
NetU1000_B17: U1000.B17(LPDDR3_A2___|__DDR3_CS0N___|__LPDDR4_CS0N_B____|__DDR4_ODT1_____|__AC28) ; port LPDDR4_CS0n_B
NetU1000_B18: U1000.B18(LPDDR3_A0___|__DDR3_A5_____|__LPDDR4_A0_B______|__DDR4_A7_______|___AC7) ; port LPDDR4_A0_B
NetU1000_B20: U1000.B20(DDR_DQ1_B___|__DDR4_DQU3_B___|__LPDDR4_DQ1_B___|__DDR3_DQ20__|__LPDDR3_DQ21) ; port LPDDR4_DQ1_B
NetU1000_B21: U1000.B21(DDR_DM0_B___|__DDR4_DMU_B____|__LPDDR4_DM0_B___|__DDR3_DM2___|__LPDDR3_DM2) ; port LPDDR4_DM0_B
NetU1000_B22: U1000.B22(DDR_DQ0_B___|__DDR4_DQU7_B___|__LPDDR4_DQ0_B___|__DDR3_DQ16__|__LPDDR3_DQ17) ; port LPDDR4_DQ0_B
NetU1000_B23: U1000.B23(DDR_DQ5_B___|__DDR4_DQU4_B___|__LPDDR4_DQ5_B___|__DDR3_DQ23__|__LPDDR3_DQ19) ; port LPDDR4_DQ5_B
NetU1000_B24: U1000.B24(DDR_DQ13_B__|__DDR4_DQL7_B___|__LPDDR4_DQ13_B__|__DDR3_DQ31__|__LPDDR3_DQ5) ; port LPDDR4_DQ13_B
NetU1000_B25: U1000.B25(DDR_DQ15_B__|__DDR4_DQL3_B___|__LPDDR4_DQ15_B__|__DDR3_DQ29__|__LPDDR3_DQ7) ; port LPDDR4_DQ15_B
NetU1000_B26: U1000.B26(DDR_DQ11_B__|__DDR4_DQL6_B___|__LPDDR4_DQ11_B__|__DDR3_DQ24__|__LPDDR3_DQ6) ; port LPDDR4_DQ11_B
NetU1000_B27: U1000.B27(DDR_DQ10_B__|__DDR4_DQL2_B___|__LPDDR4_DQ10_B__|__DDR3_DQ28__|__LPDDR3_DQ2) ; port LPDDR4_DQ10_B
NetU1000_C1: U1000.C1(DDR_DQ9_A___|__DDR4_DQU5_A___|__LPDDR4_DQ9_A___|__DDR3_DQ10__|__LPDDR3_DQ13) ; port LPDDR4_DQ9_A
NetU1000_C2: U1000.C2(DDR_DQ8_A___|__DDR4_DQU1_A___|__LPDDR4_DQ8_A___|__DDR3_DQ14__|__LPDDR3_DQ9) ; port LPDDR4_DQ8_A
NetU1000_C5: U1000.C5(DDR_DQ4_A___|__DDR4_DQL5_A___|__LPDDR4_DQ4_A___|__DDR3_DQ1___|__LPDDR3_DQ24) ; port LPDDR4_DQ4_A
NetU1000_C6: U1000.C6(DDR_DQ7_A___|__DDR4_DQL3_A___|__LPDDR4_DQ7_A___|__DDR3_DQ5___|__LPDDR3_DQ29) ; port LPDDR4_DQ7_A
NetU1000_C8: U1000.C8(DDR_DQ3_A___|__DDR4_DQL4_A___|__LPDDR4_DQ3_A___|__DDR3_DQ6___|__LPDDR3_DQ27) ; port LPDDR4_DQ3_A
NetU1000_C10: U1000.C10(LPDDR3_A7___|__DDR3_A0_____|__LPDDR4_A2_A______|__DDR4_A15_CASN_|__AC15) ; port LPDDR4_A2_A
NetU1000_C11: U1000.C11(LPDDR3_A5___|__DDR3_CS1N___|__LPDDR4_CS1N_A____|__DDR4_CS1N_____|__AC26) ; port LPDDR4_CS1n_A
NetU1000_C12: U1000.C12(LPDDR3_CKE__|__DDR3_CKE____|__LPDDR4_CKE0_A____|__DDR4_CKE0_____|__AC22) ; port LPDDR4_CKE0_A
NetU1000_C16: U1000.C16(LPDDR3_CS0N_|__DDR3_A10____|__LPDDR4_CKE0_B____|__DDR4_A10______|__AC10) ; port LPDDR4_CKE0_B
NetU1000_C17: U1000.C17(LPDDR3_A4___|__DDR3_ODT0___|__LPDDR4_CS1N_B____|__DDR4_ODT0_____|__AC27) ; port LPDDR4_CS1n_B
NetU1000_C18: U1000.C18(LPDDR3_A3___|__DDR3_A1_____|__LPDDR4_A2_B______|__DDR4_BA0______|__AC18) ; port LPDDR4_A2_B
NetU1000_C20: U1000.C20(DDR_DQ3_B___|__DDR4_DQU5_B___|__LPDDR4_DQ3_B___|__DDR3_DQ18__|__LPDDR3_DQ20) ; port LPDDR4_DQ3_B
NetU1000_C22: U1000.C22(DDR_DQ6_B___|__DDR4_DQU2_B___|__LPDDR4_DQ6_B___|__DDR3_DQ19__|__LPDDR3_DQ18) ; port LPDDR4_DQ6_B
NetU1000_C23: U1000.C23(DDR_DQ4_B___|__DDR4_DQU0_B___|__LPDDR4_DQ4_B___|__DDR3_DQ21__|__LPDDR3_DQ23) ; port LPDDR4_DQ4_B
NetU1000_C26: U1000.C26(DDR_DQ8_B___|__DDR4_DQL0_B___|__LPDDR4_DQ8_B___|__DDR3_DQ26__|__LPDDR3_DQ0) ; port LPDDR4_DQ8_B
NetU1000_C27: U1000.C27(DDR_DQ9_B___|__DDR4_DQL4_B___|__LPDDR4_DQ9_B___|__DDR3_DQ30__|__LPDDR3_DQ1) ; port LPDDR4_DQ9_B

Not connected (* = marked no-connect by the designer): U1000 1B6(--__________|__DDR3_A2_____|__--_______________|__DDR4_A1_______|___AC1)* 1B7(--__________|__DDR3_BA2____|__LPDDR4_ODT1_CA_A_|__DDR4_BG1______|__AC21)* 1B10(--__________|__DDR3_WEN____|__LPDDR4_ODT1_CA_B_|__DDR4_BG0______|__AC20)* 1C9(DDR_VREFOUT)* B9(LPDDR3_A9___|__DDR3_A7_____|__LPDDR4_ODT0_CA_A_|__DDR4_A8_______|___AC8)* B19(LPDDR3_ODT1_|__DDR3_A8_____|__LPDDR4_ODT0_CA_B_|__DDR4_A13______|__AC13)*

### Notes on the sheet
- RK3562_E(DDRPHY)
- (near R1101) USE LP4/LP4X,  R1101 PULL UP TO VCC_DDR
- Caps should be
  placed under
  the U1000 package
- (in symbol SOC_RK3562, part E) DDR4; LPDDR4; DDR3; LPDDR3; Note: Sequences can not be swap. Note the CLK polarity.; VDDQ; VDDQL; DDR3L; 1.35V; 1.50V; 1.20V; 1.10V; LPDDR4X; 0.60V; Note: / Except DDR3\DDR4, other DQ sequences / can not be swap

### Library data of the parts
C1100 = CAP NP: cap,100.00nF,+/-10%,10V,X5R,C0201; Part Reference: C1100; Manufacturer PN: C0603X5R1A104K030BC; Manufacturer: TDK; Tolerance: 10%; Priority: A; PCB Footprint: C0201; Value: 100nF; Created by: JJJ; Part Type: C0201; RK PN: C0603X5R1A104K030BC; ClassName: RK
C1101 = CAP NP: cap,100.00nF,+/-10%,10V,X5R,C0201; Part Reference: C1101; Manufacturer PN: C0603X5R1A104K030BC; Manufacturer: TDK; Tolerance: 10%; Priority: A; PCB Footprint: C0201; Value: 100nF; Created by: JJJ; Part Type: C0201; RK PN: C0603X5R1A104K030BC; ClassName: RK
C1102 = CAP NP: cap,4.70uF,+/-10%,6.3V,X5R,C0402; Part Reference: C1102; Manufacturer: TDK; RK PN: C1005X5R0J475K050BC; Priority: A; Tolerance: 10%; PCB Footprint: C0402; Value: 4.7uF; Part Type: C0402; Manufacturer PN: C1005X5R0J475K050BC; Created by: JJJ; ClassName: RK
C1103 = CAP NP: cap,10.00uF,+/-10%,6.3V,X5R,C0603; Part Reference: C1103; Manufacturer PN: C1608X5R0J106K080AB; Manufacturer: TDK; Tolerance: 10%; Priority: A; PCB Footprint: C0603; Value: 10uF; Created by: JJJ; Part Type: C0603; RK PN: C1608X5R0J106K080AB; ClassName: RK
C1104 = CAP NP: cap,100.00nF,+/-10%,10V,X5R,C0201; Part Reference: C1104; Manufacturer PN: C0603X5R1A104K030BC; Manufacturer: TDK; Tolerance: 10%; Priority: A; PCB Footprint: C0201; Value: 100nF; Created by: JJJ; Part Type: C0201; RK PN: C0603X5R1A104K030BC; ClassName: RK
C1105 = CAP NP: cap,100.00nF,+/-10%,10V,X5R,C0201; Part Reference: C1105; Manufacturer PN: C0603X5R1A104K030BC; Manufacturer: TDK; Tolerance: 10%; Priority: A; PCB Footprint: C0201; Value: 100nF; Created by: JJJ; Part Type: C0201; RK PN: C0603X5R1A104K030BC; ClassName: RK
C1106 = CAP NP: cap,4.70uF,+/-10%,6.3V,X5R,C0402; Part Reference: C1106; Manufacturer: TDK; RK PN: C1005X5R0J475K050BC; Priority: A; Tolerance: 10%; PCB Footprint: C0402; Value: 4.7uF; Part Type: C0402; Manufacturer PN: C1005X5R0J475K050BC; Created by: JJJ; ClassName: RK
C1107 = CAP NP: cap,4.70uF,+/-10%,6.3V,X5R,C0402; Part Reference: C1107; Manufacturer PN: C1005X5R0J475K050BC; Manufacturer: TDK; Tolerance: 10%; Priority: A; PCB Footprint: C0402; Value: 4.7uF; Created by: JJJ; Part Type: C0402; RK PN: C1005X5R0J475K050BC; ClassName: RK
C1108 = CAP NP: cap,100.00nF,+/-10%,10V,X5R,C0201; Part Reference: C1108; Manufacturer: TDK; RK PN: C0603X5R1A104K030BC; Priority: A; Tolerance: 10%; PCB Footprint: C0201; Value: 100nF; Part Type: C0201; Manufacturer PN: C0603X5R1A104K030BC; Created by: JJJ; ClassName: RK
C1109 = CAP NP: cap,100.00nF,+/-10%,10V,X5R,C0201; Part Reference: C1109; Manufacturer: TDK; RK PN: C0603X5R1A104K030BC; Priority: A; Tolerance: 10%; PCB Footprint: C0201; Value: 100nF; Part Type: C0201; Manufacturer PN: C0603X5R1A104K030BC; Created by: JJJ; ClassName: RK
R1101 = RESISTOR: 通用厚膜电阻,120R,+/-1%,R0201,1/20W.; Part Reference: R1101; Manufacturer PN: RC0201FR-07120RL; Manufacturer: YAGEO; Wattage: 1/20W; Priority: A; PCB Footprint: R0201; Value: 120R; Created by: YTL; Part Type: 通用厚膜电阻; RK PN: RC0201FR-07120RL; ClassName: RK
U1000 = SOC_RK3562: ROCKCHIP SOC; Part Reference: U1000; Manufacturer: Rockchip (瑞芯微); SPLIT_INST: TRUE; SWAP_INFO: (S1+S2+S3+S4+S5+S6+S7+S8+S9+S10+S11+S12+S13+S14+S15+S16); RK PN: 906000425; Priority: A; PCB Footprint: BGA478_13R90X13R90X0R95; Value: RK3562; Part Type: SOC; Manufacturer PN: RK3562; Created by: JJJ; ClassName: RK

## Sheet RK3562-PMUIO-OSC-PLL.SchDoc
size 420 x 297 mm; SheetNumber: 6; SheetTotal: 32
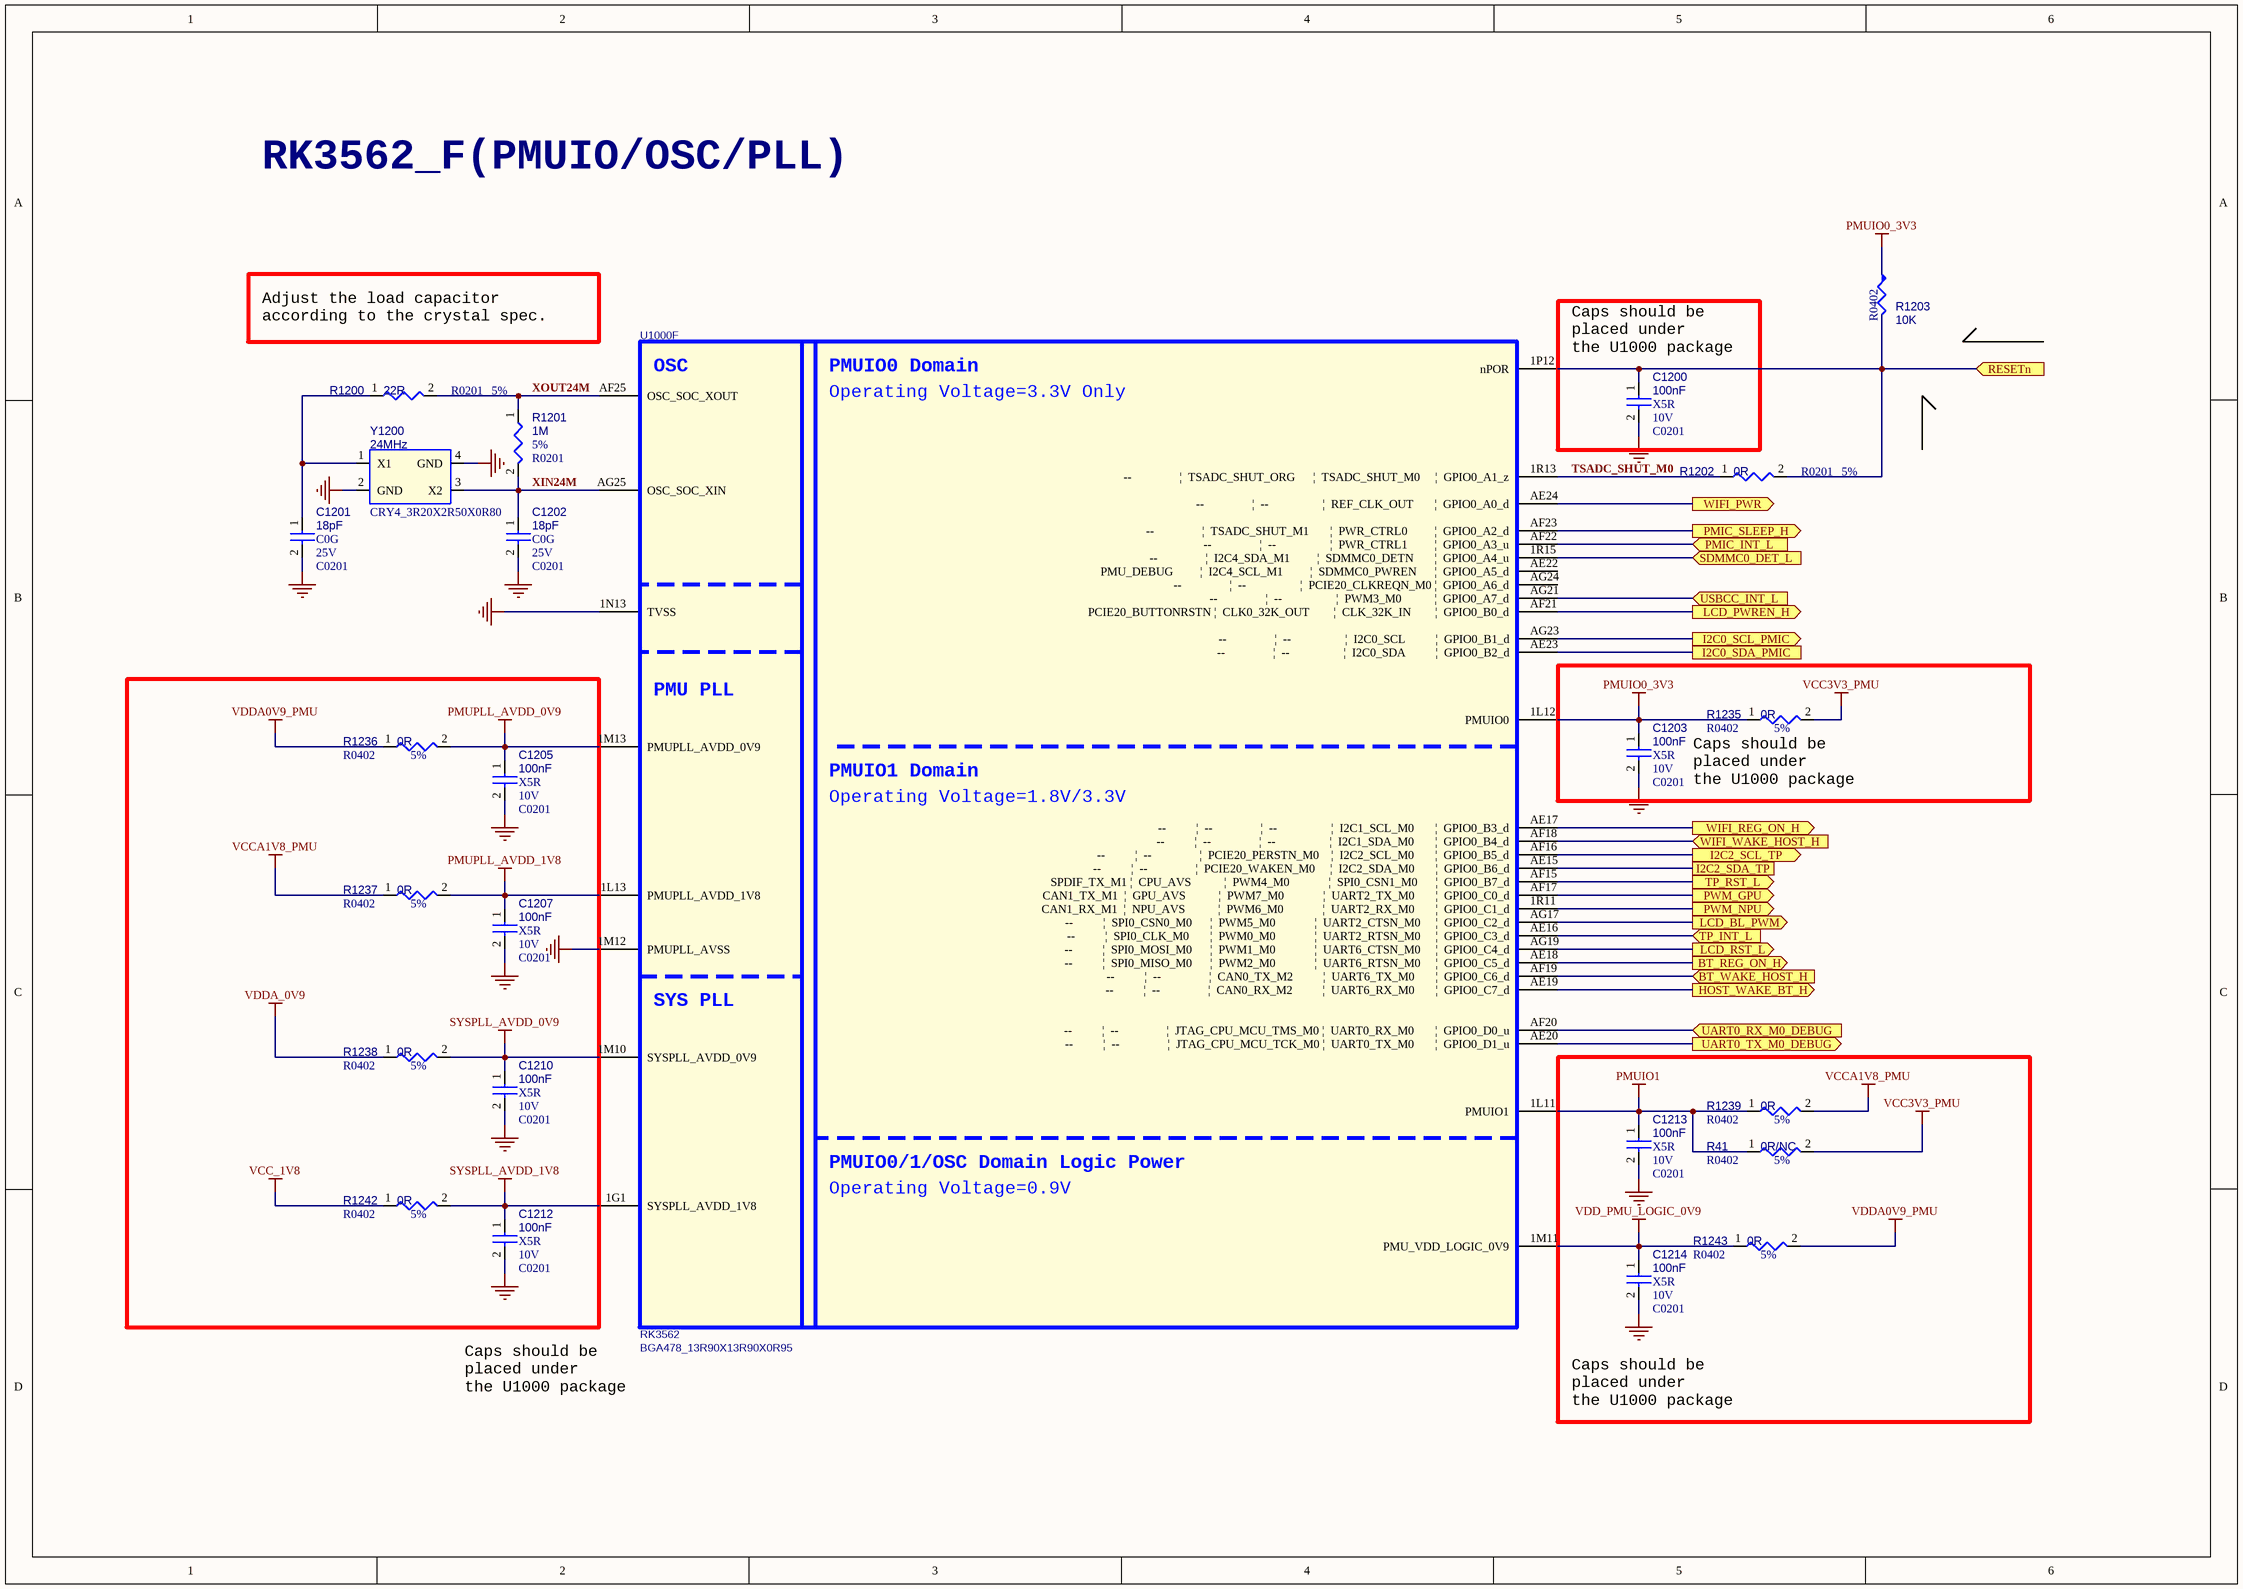
[diagram p7: RK3562-PMUIO-OSC-PLL.SchDoc]

### Parts
C1200  100nF  Dielectric: X5R  Voltage: 10V  [C0201]
C1201  18pF  Dielectric: C0G  Voltage: 25V  [C0201]
C1202  18pF  Dielectric: C0G  Voltage: 25V  [C0201]
C1203  100nF  Dielectric: X5R  Voltage: 10V  [C0201]
C1205  100nF  Dielectric: X5R  Voltage: 10V  [C0201]
C1207  100nF  Dielectric: X5R  Voltage: 10V  [C0201]
C1210  100nF  Dielectric: X5R  Voltage: 10V  [C0201]
C1212  100nF  Dielectric: X5R  Voltage: 10V  [C0201]
C1213  100nF  Dielectric: X5R  Voltage: 10V  [C0201]
C1214  100nF  Dielectric: X5R  Voltage: 10V  [C0201]
R41  0R/NC  Tolerance: 5%  [R0402]
R1200  22R  Tolerance: 5%  [R0201]
R1201  1M  Tolerance: 5%  [R0201]
R1202  0R  Tolerance: 5%  [R0201]
R1203  10K  [R0402]
R1235  0R  Tolerance: 5%  [R0402]
R1236  0R  Tolerance: 5%  [R0402]
R1237  0R  Tolerance: 5%  [R0402]
R1238  0R  Tolerance: 5%  [R0402]
R1239  0R  Tolerance: 5%  [R0402]
R1242  0R  Tolerance: 5%  [R0402]
R1243  0R  Tolerance: 5%  [R0402]
U1000  RK3562  [BGA478_13R90X13R90X0R95]  (part F of 16)
Y1200  24MHz  [CRY4_3R20X2R50X0R80]

### Ports
BT_REG_ON_H (out, see CONTROLLER-RK3562[6A], CONTROLLER-RK3562[7A], WF-BT-AP6256[1A]), BT_WAKE_HOST_H (in, see CONTROLLER-RK3562[6A], CONTROLLER-RK3562[7A], WF-BT-AP6256[1A]), HOST_WAKE_BT_H (out, see CONTROLLER-RK3562[6A], CONTROLLER-RK3562[7A], WF-BT-AP6256[1A]), I2C0_SCL_PMIC (out, see CONTROLLER-RK3562[6A], RK-POWER-SUPPLY[1A]), I2C0_SDA_PMIC (see CONTROLLER-RK3562[6A], RK-POWER-SUPPLY[1A]), I2C2_SCL_TP (out, see CONTROLLER-RK3562[6A]), I2C2_SDA_TP (see CONTROLLER-RK3562[6A]), LCD_BL_PWM (out, see CONTROLLER-RK3562[6A]), LCD_PWREN_H (out, see CONTROLLER-RK3562[6A]), LCD_RST_L (out, see CONTROLLER-RK3562[6A]), PMIC_INT_L (in, see CONTROLLER-RK3562[6A], RK-POWER-SUPPLY[1A]), PMIC_SLEEP_H (out, see CONTROLLER-RK3562[6A], RK-POWER-SUPPLY[1A]), PWM_GPU (out, see CONTROLLER-RK3562[6A]), PWM_NPU (out, see CONTROLLER-RK3562[6A], RK-PERIPHERAL-POWER[2A]), RESETn (in, see CONTROLLER-RK3562[6A], RK-POWER-SUPPLY[1A]), SDMMC0_DET_L (in, see CONTROLLER-RK3562[6A], SD_TF-CARD[1A]), TP_INT_L (in, see CONTROLLER-RK3562[6A]), TP_RST_L (out, see CONTROLLER-RK3562[6A]), UART0_RX_M0_DEBUG (in, see CONTROLLER-RK3562[6A]), UART0_TX_M0_DEBUG (out, see CONTROLLER-RK3562[6A]), USBCC_INT_L (in, see CONTROLLER-RK3562[6A]), WIFI_PWR (out, see CONTROLLER-RK3562[6A]), WIFI_REG_ON_H (out, see CONTROLLER-RK3562[6A], CONTROLLER-RK3562[7A], WF-BT-AP6256[1A]), WIFI_WAKE_HOST_H (in, see CONTROLLER-RK3562[6A], CONTROLLER-RK3562[7A], WF-BT-AP6256[1A])

### Nets
GND: C1200.2 C1201.2 C1202.2 C1203.2 C1205.2 C1207.2 C1210.2 C1212.2 C1213.2 C1214.2 U1000.1M12(PMUPLL_AVSS) U1000.1N13(TVSS) Y1200.2(GND) Y1200.4(GND)
PMUIO0_3V3: C1203.1 R1203.1 R1235.1 U1000.1L12(PMUIO0)
PMUIO1: C1213.1 R41.1 R1239.1 U1000.1L11(PMUIO1)
PMUPLL_AVDD_0V9: C1205.1 R1236.2 U1000.1M13(PMUPLL_AVDD_0V9)
PMUPLL_AVDD_1V8: C1207.1 R1237.2 U1000.1L13(PMUPLL_AVDD_1V8)
SYSPLL_AVDD_0V9: C1210.1 R1238.2 U1000.1M10(SYSPLL_AVDD_0V9)
SYSPLL_AVDD_1V8: C1212.1 R1242.2 U1000.1G1(SYSPLL_AVDD_1V8)
VCC3V3_PMU: R41.2 R1235.2
VCC_1V8: R1242.1
VCCA1V8_PMU: R1237.1 R1239.2
VDD_PMU_LOGIC_0V9: C1214.1 R1243.1 U1000.1M11(PMU_VDD_LOGIC_0V9)
VDDA0V9_PMU: R1236.1 R1243.2
VDDA_0V9: R1238.1
BT_REG_ON_H: U1000.AE18(--__________|__SPI0_MISO_M0______|__PWM2_M0_____________|__UART6_RTSN_M0_____|__GPIO0_C5_d) ; port BT_REG_ON_H
BT_WAKE_HOST_H: U1000.AF19(--__________|__--________________|__CAN0_TX_M2__________|__UART6_TX_M0_______|__GPIO0_C6_d) ; port BT_WAKE_HOST_H
HOST_WAKE_BT_H: U1000.AE19(--__________|__--________________|__CAN0_RX_M2__________|__UART6_RX_M0_______|__GPIO0_C7_d) ; port HOST_WAKE_BT_H
I2C0_SCL_PMIC: U1000.AG23(--________________|__--__________________|__I2C0_SCL__________|__GPIO0_B1_d) ; port I2C0_SCL_PMIC
I2C0_SDA_PMIC: U1000.AE23(--________________|__--__________________|__I2C0_SDA__________|__GPIO0_B2_d) ; port I2C0_SDA_PMIC
PMIC_INT_L: U1000.AF22(--________________|__--__________________|__PWR_CTRL1_________|__GPIO0_A3_u) ; port PMIC_INT_L
PMIC_SLEEP_H: U1000.AF23(--________________|__TSADC_SHUT_M1_______|__PWR_CTRL0_________|__GPIO0_A2_d) ; port PMIC_SLEEP_H
PWM_NPU: U1000.1R11(CAN1_RX_M1__|__NPU_AVS___________|__PWM6_M0_____________|__UART2_RX_M0_______|__GPIO0_C1_d) ; port PWM_NPU
RESETn: C1200.1 R1202.2 R1203.2 U1000.1P12(nPOR) ; port RESETn
SD_TF-DET-L: U1000.1R15(--________________|__I2C4_SDA_M1_________|__SDMMC0_DETN_______|__GPIO0_A4_u) ; port SDMMC0_DET_L
TSADC_SHUT_M0: R1202.1 U1000.1R13(--________________|__TSADC_SHUT_ORG______|__TSADC_SHUT_M0_____|__GPIO0_A1_z)
WIFI_PWREN_L: U1000.AE24(--________________|__--__________________|__REF_CLK_OUT_______|__GPIO0_A0_d) ; port WIFI_PWR
WIFI_REG_ON_H: U1000.AE17(--__________|__--________________|__--__________________|__I2C1_SCL_M0_______|__GPIO0_B3_d) ; port WIFI_REG_ON_H
WIFI_WAKE_HOST_H: U1000.AF18(--__________|__--________________|__--__________________|__I2C1_SDA_M0_______|__GPIO0_B4_d) ; port WIFI_WAKE_HOST_H
XIN24M: C1202.1 R1201.2 U1000.AG25(OSC_SOC_XIN) Y1200.3(X2)
XOUT24M: R1200.2 R1201.1 U1000.AF25(OSC_SOC_XOUT)
NetC1201_1: C1201.1 R1200.1 Y1200.1(X1)
NetJ3_2: U1000.AF20(--__________|__--________________|__JTAG_CPU_MCU_TMS_M0_|__UART0_RX_M0_______|__GPIO0_D0_u) ; port UART0_RX_M0_DEBUG
NetJ3_3: U1000.AE20(--__________|__--________________|__JTAG_CPU_MCU_TCK_M0_|__UART0_TX_M0_______|__GPIO0_D1_u) ; port UART0_TX_M0_DEBUG
NetU1000_AE15: U1000.AE15(--__________|__--________________|__PCIE20_WAKEN_M0_____|__I2C2_SDA_M0_______|__GPIO0_B6_d) ; port I2C2_SDA_TP
NetU1000_AE16: U1000.AE16(--__________|__SPI0_CLK_M0_______|__PWM0_M0_____________|__UART2_RTSN_M0_____|__GPIO0_C3_d) ; port TP_INT_L
NetU1000_AF15: U1000.AF15(SPDIF_TX_M1_|__CPU_AVS___________|__PWM4_M0_____________|__SPI0_CSN1_M0______|__GPIO0_B7_d) ; port TP_RST_L
NetU1000_AF16: U1000.AF16(--__________|__--________________|__PCIE20_PERSTN_M0____|__I2C2_SCL_M0_______|__GPIO0_B5_d) ; port I2C2_SCL_TP
NetU1000_AF17: U1000.AF17(CAN1_TX_M1__|__GPU_AVS___________|__PWM7_M0_____________|__UART2_TX_M0_______|__GPIO0_C0_d) ; port PWM_GPU
NetU1000_AF21: U1000.AF21(PCIE20_BUTTONRSTN_|__CLK0_32K_OUT________|__CLK_32K_IN________|__GPIO0_B0_d) ; port LCD_PWREN_H
NetU1000_AG17: U1000.AG17(--__________|__SPI0_CSN0_M0______|__PWM5_M0_____________|__UART2_CTSN_M0_____|__GPIO0_C2_d) ; port LCD_BL_PWM
NetU1000_AG19: U1000.AG19(--__________|__SPI0_MOSI_M0______|__PWM1_M0_____________|__UART6_CTSN_M0_____|__GPIO0_C4_d) ; port LCD_RST_L
NetU1000_AG21: U1000.AG21(--________________|__--__________________|__PWM3_M0___________|__GPIO0_A7_d) ; port USBCC_INT_L

Not connected (* = marked no-connect by the designer): U1000 AE22(PMU_DEBUG_________|__I2C4_SCL_M1_________|__SDMMC0_PWREN______|__GPIO0_A5_d) AG24(--________________|__--__________________|__PCIE20_CLKREQN_M0_|__GPIO0_A6_d)

### Notes on the sheet
- RK3562_F(PMUIO/OSC/PLL)
- Adjust the load capacitor
  according to the crystal spec.
- Caps should be
  placed under
  the U1000 package
- (near R1235) Caps should be
  placed under
  the U1000 package
- (in symbol SOC_RK3562, part F) OSC; PMUIO0 Domain; Operating Voltage=3.3V Only; PMU PLL; PMUIO1 Domain; Operating Voltage=1.8V/3.3V; SYS PLL; PMUIO0/1/OSC Domain Logic Power; Operating Voltage=0.9V

### Library data of the parts
C1200 = CAP NP: cap,100.00nF,+/-10%,10V,X5R,C0201; Part Reference: C1200; Manufacturer PN: C0603X5R1A104K030BC; Manufacturer: TDK; Tolerance: 10%; Priority: A; PCB Footprint: C0201; Value: 100nF; Created by: JJJ; Part Type: C0201; RK PN: C0603X5R1A104K030BC; ClassName: RK
C1201 = CAP NP: 一般用片状陶瓷电容(GRM),cap,18pF,±5%,25V,C0G,C0201; Part Reference: C1201; Manufacturer PN: GRM0335C1E180JA01; Manufacturer: murata; C_Voltage: 6.3V; Priority: A; RK PN: 902004768; Number: 37; PCB Footprint: C0201; Value: 18pF; Created by: JJJ; Tolerance: ±5%; Part Type: 一般用片状陶瓷电容; ClassName: RK
C1202 = CAP NP: 一般用片状陶瓷电容(GRM),cap,18pF,±5%,25V,C0G,C0201; Part Reference: C1202; Manufacturer: murata; Manufacturer PN: GRM0335C1E180JA01; Number: 37; RK PN: 902004768; Priority: A; C_Voltage: 6.3V; PCB Footprint: C0201; Value: 18pF; Part Type: 一般用片状陶瓷电容; Tolerance: ±5%; Created by: JJJ; ClassName: RK
C1203 = CAP NP: cap,100.00nF,+/-10%,10V,X5R,C0201; Part Reference: C1203; Manufacturer PN: C0603X5R1A104K030BC; Manufacturer: TDK; Tolerance: 10%; Priority: A; PCB Footprint: C0201; Value: 100nF; Created by: JJJ; Part Type: C0201; RK PN: C0603X5R1A104K030BC; ClassName: RK
C1205 = CAP NP: cap,100.00nF,+/-10%,10V,X5R,C0201; Part Reference: C1205; Manufacturer: TDK; RK PN: C0603X5R1A104K030BC; Priority: A; Tolerance: 10%; PCB Footprint: C0201; Value: 100nF; Part Type: C0201; Manufacturer PN: C0603X5R1A104K030BC; Created by: JJJ; ClassName: RK
C1207 = CAP NP: cap,100.00nF,+/-10%,10V,X5R,C0201; Part Reference: C1207; Manufacturer: TDK; RK PN: C0603X5R1A104K030BC; Priority: A; Tolerance: 10%; PCB Footprint: C0201; Value: 100nF; Part Type: C0201; Manufacturer PN: C0603X5R1A104K030BC; Created by: JJJ; ClassName: RK
C1210 = CAP NP: cap,100.00nF,+/-10%,10V,X5R,C0201; Part Reference: C1210; Manufacturer: TDK; RK PN: C0603X5R1A104K030BC; Priority: A; Tolerance: 10%; PCB Footprint: C0201; Value: 100nF; Part Type: C0201; Manufacturer PN: C0603X5R1A104K030BC; Created by: JJJ; ClassName: RK
C1212 = CAP NP: cap,100.00nF,+/-10%,10V,X5R,C0201; Part Reference: C1212; Manufacturer PN: C0603X5R1A104K030BC; Manufacturer: TDK; Tolerance: 10%; Priority: A; PCB Footprint: C0201; Value: 100nF; Created by: JJJ; Part Type: C0201; RK PN: C0603X5R1A104K030BC; ClassName: RK
C1213 = CAP NP: cap,100.00nF,+/-10%,10V,X5R,C0201; Part Reference: C1213; Manufacturer: TDK; RK PN: C0603X5R1A104K030BC; Priority: A; Tolerance: 10%; PCB Footprint: C0201; Value: 100nF; Part Type: C0201; Manufacturer PN: C0603X5R1A104K030BC; Created by: JJJ; ClassName: RK
C1214 = CAP NP: cap,100.00nF,+/-10%,10V,X5R,C0201; Part Reference: C1214; Manufacturer PN: C0603X5R1A104K030BC; Manufacturer: TDK; Tolerance: 10%; Priority: A; PCB Footprint: C0201; Value: 100nF; Created by: JJJ; Part Type: C0201; RK PN: C0603X5R1A104K030BC; ClassName: RK
R41 R1235-R1239 R1242 R1243 = RESISTOR: 通用厚膜电阻,0R,+/-5%,R0402,1/16W.; Part Reference: R1604; Manufacturer PN: RC0402JR-070RL; Manufacturer: YAGEO; Wattage: 1/16W; Priority: A; RK PN: 901001446; PCB Footprint: R0402; Value: 0R; Created by: YTL; Part Type: 通用厚膜电阻; ClassName: RK
R1200 = RESISTOR: 通用厚膜电阻,22R,+/-5%,R0201,1/20W.; Part Reference: R1200; Manufacturer PN: RC0201JR-0722RL; Manufacturer: YAGEO; Wattage: 1/20W; Priority: A; RK PN: 901000523; PCB Footprint: R0201; Value: 22R; Created by: YTL; Part Type: 通用厚膜电阻; ClassName: RK
R1201 = RESISTOR: 通用厚膜电阻,1M,+/-5%,R0201,1/20W.; Part Reference: R1201; Manufacturer PN: RC0201JR-071ML; Manufacturer: YAGEO; Wattage: 1/20W; Priority: A; RK PN: 901000512; PCB Footprint: R0201; Value: 1M; Created by: YTL; Part Type: 通用厚膜电阻; ClassName: RK
R1202 = RESISTOR: 通用厚膜电阻,0R,+/-5%,R0201,1/20W.; Part Reference: R1202; Manufacturer PN: RC0201JR-070RL; Manufacturer: YAGEO; Wattage: 1/20W; Priority: A; RK PN: 901000473; PCB Footprint: R0201; Value: 0R; Created by: YTL; Part Type: 通用厚膜电阻; ClassName: RK
R1203 = RESISTOR5: 通用厚膜电阻,10K,+/-5%,R0402,1/16W.; Part Reference: R2245; Manufacturer PN: RC0402JR-0710KL; Manufacturer: YAGEO; Tolerance: 5%; Wattage: 1/16W; Priority: A; RK PN: 901001449; PCB Footprint: R0402; Value: 10K; Created by: YTL; Part Type: 通用厚膜电阻; ClassName: RK
U1000 = SOC_RK3562: as U1000 on sheet RK3562-DDR-PHY; PCB Footprint: BGA478_13R90X13R90X0R95; Value: RK3562; Part Type: SOC; Manufacturer PN: RK3562; Created by: JJJ; ClassName: RK
Y1200 = CRYSTAL_4P: 无源晶振，24M，3225,±10ppm，8pF，Hosonic; Part Reference: Y1200; Manufacturer PN: E3SB24.0000F08E11; Manufacturer: Hosonic(鸿星电子); Priority: A; PCB Footprint: CRY4_3R20X2R50X0R80; Value: 24MHz; Created by: JJJ; Part Type: CRYSTAL; RK PN: E3SB24.0000F08E11; ClassName: RK

## Sheet RK3562-VCCIO1.SchDoc
size 297 x 209 mm; SheetNumber: 7; SheetTotal: 32
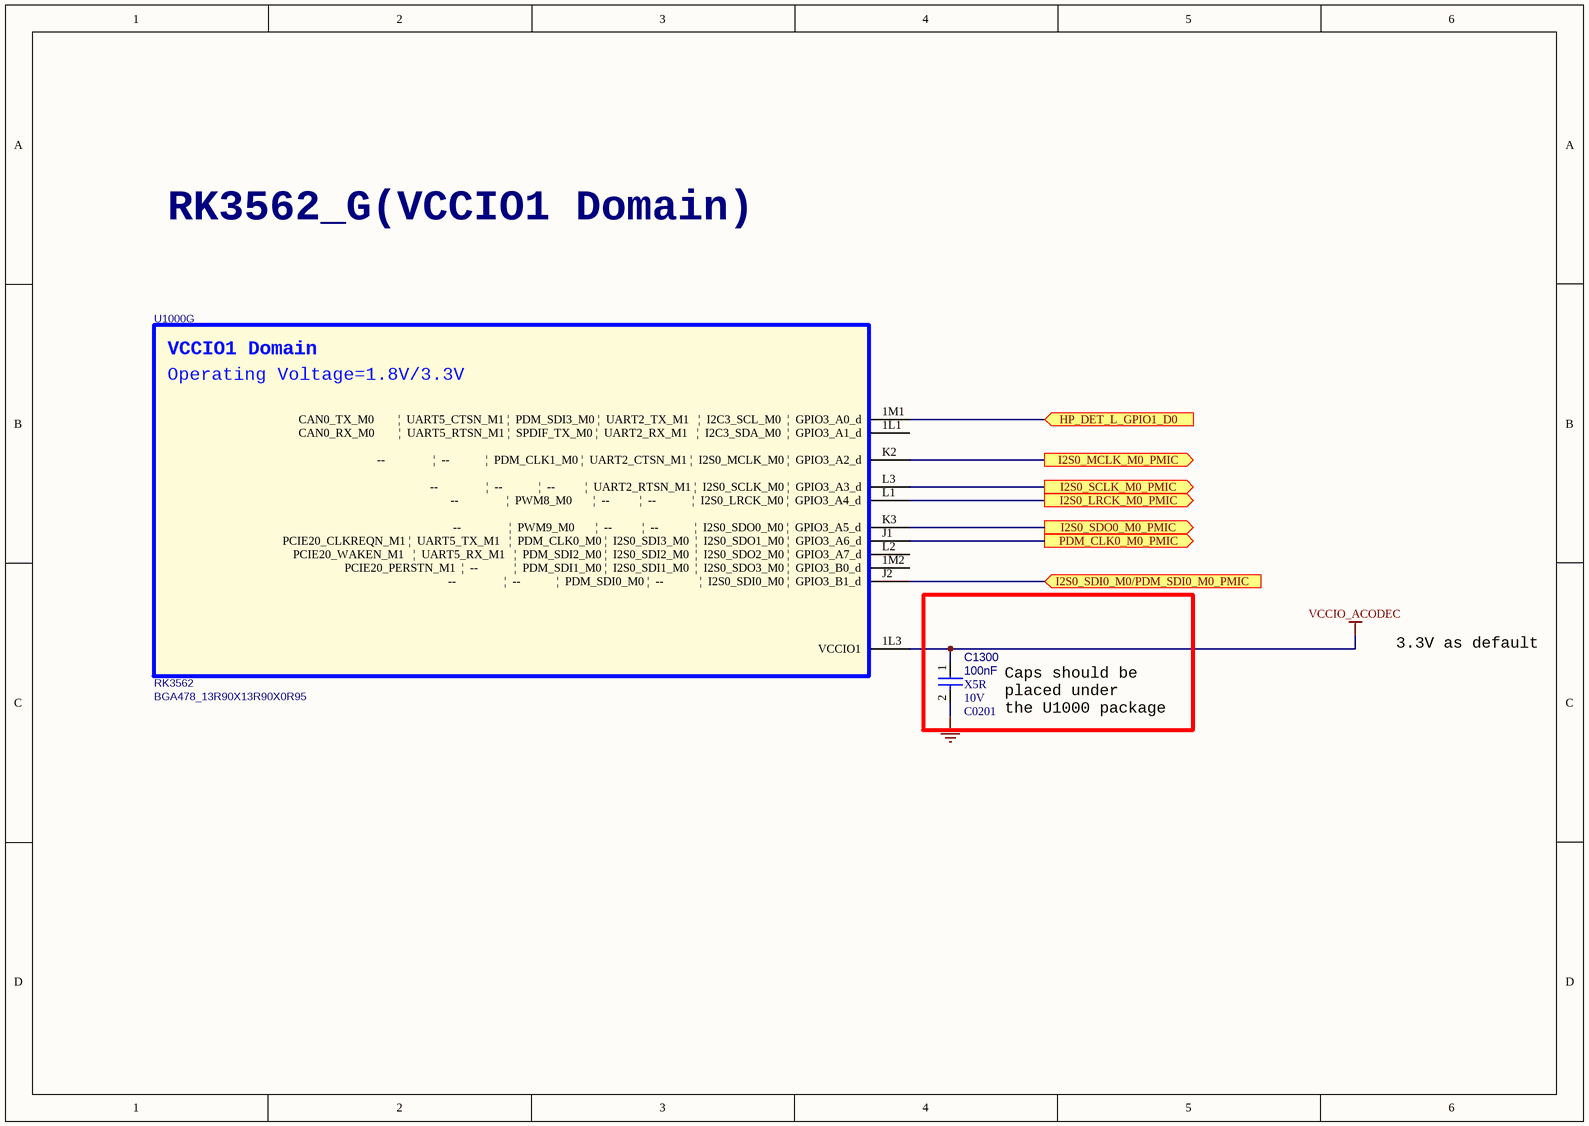
[diagram p8: RK3562-VCCIO1.SchDoc]

### Parts
C1300  100nF  Dielectric: X5R  Voltage: 10V  [C0201]
U1000  RK3562  [BGA478_13R90X13R90X0R95]  (part G of 16)

### Ports
HP_DET_L_GPIO1_D0 (in, see CONTROLLER-RK3562[4A]), I2S0_LRCK_M0_PMIC (out, see CONTROLLER-RK3562[4A], RK-POWER-SUPPLY[3A]), I2S0_MCLK_M0_PMIC (out, see CONTROLLER-RK3562[4A], RK-POWER-SUPPLY[3A]), I2S0_SCLK_M0_PMIC (out, see CONTROLLER-RK3562[4A], RK-POWER-SUPPLY[3A]), I2S0_SDI0_M0/PDM_SDI0_M0_PMIC (in, see CONTROLLER-RK3562[4A], RK-POWER-SUPPLY[3A]), I2S0_SDO0_M0_PMIC (out, see CONTROLLER-RK3562[4A], RK-POWER-SUPPLY[3A]), PDM_CLK0_M0_PMIC (out, see CONTROLLER-RK3562[4A], RK-POWER-SUPPLY[3A])

### Nets
GND: C1300.2
VCCIO_ACODEC: C1300.1 U1000.1L3(VCCIO1)
I2S0_LRCK_M0_PMIC: U1000.L1(--________________|__PWM8_M0_______|__--__________|__--____________|__I2S0_LRCK_M0_|__GPIO3_A4_d) ; port I2S0_LRCK_M0_PMIC
I2S0_MCLK_M0_PMIC: U1000.K2(--________________|__--____________|__PDM_CLK1_M0_|__UART2_CTSN_M1_|__I2S0_MCLK_M0_|__GPIO3_A2_d) ; port I2S0_MCLK_M0_PMIC
I2S0_SCLK_M0_PMIC: U1000.L3(--________________|__--____________|__--__________|__UART2_RTSN_M1_|__I2S0_SCLK_M0_|__GPIO3_A3_d) ; port I2S0_SCLK_M0_PMIC
I2S0_SDI0_M0/PDM_SDI0_M0_PMIC: U1000.J2(--________________|__--____________|__PDM_SDI0_M0_|__--____________|__I2S0_SDI0_M0_|__GPIO3_B1_d) ; port I2S0_SDI0_M0/PDM_SDI0_M0_PMIC
I2S0_SDO0_M0_PMIC: U1000.K3(--________________|__PWM9_M0_______|__--__________|__--____________|__I2S0_SDO0_M0_|__GPIO3_A5_d) ; port I2S0_SDO0_M0_PMIC
PDM_CLK0_M0_PMIC: U1000.J1(PCIE20_CLKREQN_M1_|__UART5_TX_M1___|__PDM_CLK0_M0_|__I2S0_SDI3_M0__|__I2S0_SDO1_M0_|__GPIO3_A6_d) ; port PDM_CLK0_M0_PMIC
NetU1000_1M1: U1000.1M1(CAN0_TX_M0________|__UART5_CTSN_M1_|__PDM_SDI3_M0_|__UART2_TX_M1___|__I2C3_SCL_M0__|__GPIO3_A0_d) ; port HP_DET_L_GPIO1_D0

Not connected (* = marked no-connect by the designer): U1000 1L1(CAN0_RX_M0________|__UART5_RTSN_M1_|__SPDIF_TX_M0_|__UART2_RX_M1___|__I2C3_SDA_M0__|__GPIO3_A1_d) 1M2(PCIE20_PERSTN_M1__|__--____________|__PDM_SDI1_M0_|__I2S0_SDI1_M0__|__I2S0_SDO3_M0_|__GPIO3_B0_d) L2(PCIE20_WAKEN_M1___|__UART5_RX_M1___|__PDM_SDI2_M0_|__I2S0_SDI2_M0__|__I2S0_SDO2_M0_|__GPIO3_A7_d)

### Notes on the sheet
- RK3562_G(VCCIO1 Domain)
- 3.3V as default
- Caps should be
  placed under
  the U1000 package
- (in symbol SOC_RK3562, part G) VCCIO1 Domain; Operating Voltage=1.8V/3.3V

### Library data of the parts
C1300 = CAP NP: cap,100.00nF,+/-10%,10V,X5R,C0201; Part Reference: C1300; Manufacturer: TDK; RK PN: C0603X5R1A104K030BC; Priority: A; Tolerance: 10%; PCB Footprint: C0201; Value: 100nF; Part Type: C0201; Manufacturer PN: C0603X5R1A104K030BC; Created by: JJJ; ClassName: RK
U1000 = SOC_RK3562: as U1000 on sheet RK3562-DDR-PHY; PCB Footprint: BGA478_13R90X13R90X0R95; Value: RK3562; Part Type: SOC; Manufacturer PN: RK3562; Created by: JJJ; ClassName: RK